# Altium project Robot Controller.PrjPcb
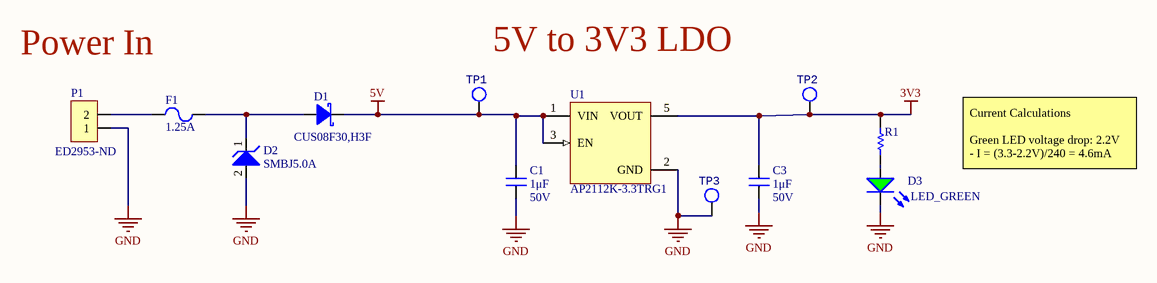
[diagram p0: SH1 - POWER.SchDoc]
6 sheets, 219 parts. Net scope: flat (ports and power ports of the same name join across sheets).
Board file: Robot Controller.PcbDoc
Sheets:
  SH1 - POWER.SchDoc
  SH2 - MCU.SchDoc
  SH3 - USB.SchDoc
  SH4 - GIMBDRIVE CONTROLS.SchDoc
  SH5 - ARM CONTROLS.SchDoc
  SH6 - SCIENCE CONTROLS.SchDoc

## Sheet SH1 - POWER.SchDoc: Power
size B; CheckedBy: Lance Bantoto; Engineer: Christopher Arjune; Organization: UW Robotics; Address1: 200 University Avenue; Address2: Waterloo; Address3: Ontario; Address4: Canada N2L 3G6; Revision: 1; SheetNumber: 1; SheetTotal: 6

### Parts
C1  value 1μF  Voltage Rating: 50V  [CAP2012]  (hidden comment: CAP_1uF_50V_0805)
C3  value 1μF  Voltage Rating: 50V  [CAP2012]  (hidden comment: CAP_1uF_50V_0805)
D1  Manufacturer Part Number 1: CUS08F30,H3F  [SOD-323_UNIDIR]  (hidden comment: DIO_SCHOTTKY_30V_800mA)
D2  TVS_DIODE_UNIDIR_5V  [SMBJ5.0A]  (value not drawn)
D3  LED_GREEN  [LED_0805_GREEN]
F1  Current Rating: 1.25A  [FUSE_1206]  (hidden comment: FUSE_1.25A_1206)
P1  Supplier Part Number 1: ED2953-ND  [OSTYK51102030]  (hidden comment: CONN_TERMINAL_2)
R1  240  [RESC0805]  (value not drawn)
TP1  TESTPOINT_LOOP  [TESTPOINT_LOOP]  (value not drawn)
TP2  TESTPOINT_LOOP  [TESTPOINT_LOOP]  (value not drawn)
TP3  TESTPOINT_LOOP  [TESTPOINT_LOOP]  (value not drawn)
U1  Manufacturer Part Number 1: AP2112K-3.3TRG1  [SOT95P285X140-5N]  (hidden comment: LDO_3.3V_600mA)

### Nets
3V3: C3.1 R1.2 TP2.1 U1.5(VOUT)
5V: C1.1 D1.2(Cathode) TP1.1 U1.1(VIN) U1.3(EN)
GND: C1.2 C3.2 D2.2 D3.2(K) P1.1 TP3.1 U1.2(GND)
NetD1_1: D1.1(Anode) D2.1 F1.2
NetD3_1: D3.1(A) R1.1
NetF1_1: F1.1 P1.2

### Notes on the sheet
- Power In
- 5V to 3V3 LDO
- Current Calculations
  Green LED voltage drop: 2.2V
  - I = (3.3-2.2V)/240 = 4.6mA
- Title:
- Project:
- Date:
- Rev:
- Checker:
- Engineer:
- Sheet:
- of

### Library data of the parts
C1 C3 = CAP_1uF_50V_0805: CAP CER 1UF 50V X7R 0805; Manufacturer 1: Samsung Electro-Mechanics; Manufacturer Part Number 1: CL21B105KBFNNNG; Package/Footprint: 0805; Supplier 1: Digi-Key; Supplier Part Number 1: 1276-6470-1-ND; Mounting Type: SMD; LCSC Part #: C28323
D1 = DIO_SCHOTTKY_30V_800mA: DIODE SCHOTTKY 30V 800MA USC; Manufacturer 1: Toshiba Semiconductor and Storage; Vf (Max): 220mV; Supplier 1: Digi-Key; Supplier Part Number 1: CUS08F30H3FCT-ND; Vr (Max): 30V; Io: 800mA; Mounting Type: SMD
D2 = TVS_DIODE_UNIDIR_5V: TVS DIODE 5V 9.2V SMB; Manufacturer 1: Bourns; Supplier 1: Digi-Key; Supplier Part Number 1: SMBJ5.0ABCT-ND; Manufacturer Part Number 1: SMBJ5.0A; Mounting Type: SMD; Package/Footprint: SMB
D3 = LED_GREEN: LED GREEN DIFFUSED 0805 SMD; Manufacturer Part Number 1: LG R971-KN-1; Manufacturer 1: OSRAM; Forward Voltage Drop: 2.2V; Package/Footprint: 0805; Supplier Part Number 1: 475-1410-1-ND; Supplier 1: Digi-Key; Mounting Type: SMD
F1 = FUSE_1.25A_1206: FUSE BOARD MOUNT 1.25A 63VAC/VDC 1206; Manufacturer 1: Littelfuse; Manufacturer Part Number 1: 04661.25NRHF; Voltage Rating (DC): 63V; Package/Footprint: 1206; Supplier 1: Digi-Key; Supplier Part Number 1: F11418CT-ND; Mounting Type: SMD; LCSC Part #: *
P1 = CONN_TERMINAL_2: Header, 2-Pin; Manufacturer 1: On Shore Technology Inc.; Manufacturer Part Number 1: OSTYK51102030; Supplier 1: Digi-Key
R1 = RES_240Ω_0805_1%: RES 240 OHM 1% 1/8W 0805; Manufacturer 1: Vishay; Manufacturer Part Number 1: CRCW0805240RFKEA; Supplier 1: Digi-Key; Supplier Part Number 1: 541-240CCT-ND
TP1-TP3 = TESTPOINT_LOOP: TESTPOINT THRUHOLE; Manufacturer 1: Keystone Electronics; Manufacturer Part Number 1: 5002; Package/Footprint: TH; Supplier Part Number 1: 36-5002-ND; Supplier 1: Digi-Key; Mounting Type: TH
U1 = LDO_3.3V_600mA: IC REG LINEAR 3.3V 600MA SOT25; Manufacturer 1: Diodes Incorporated; Input Voltage (Max): 6V; Voltage Dropout (Max): 0.4V; Package/Footprint: SOT-25; Supplier 1: Digi-Key; Supplier Part Number 1: AP2112K-3.3TRG1DICT-ND; Output Voltage (Fixed): 3.3V; Output Current: 600mA; Operating Temperature: -40°C - 85°C; LCSC Part #: C51118; Mounting Type: SMD

## Sheet SH2 - MCU.SchDoc: Microcontroller
size B; CheckedBy: Lance Bantoto; Engineer: Christopher Arjune; Organization: UW Robotics; Address1: 200 University Avenue; Address2: Waterloo; Address3: Ontario; Address4: Canada N2L 3G6; Revision: 1; SheetNumber: 2; SheetTotal: 6
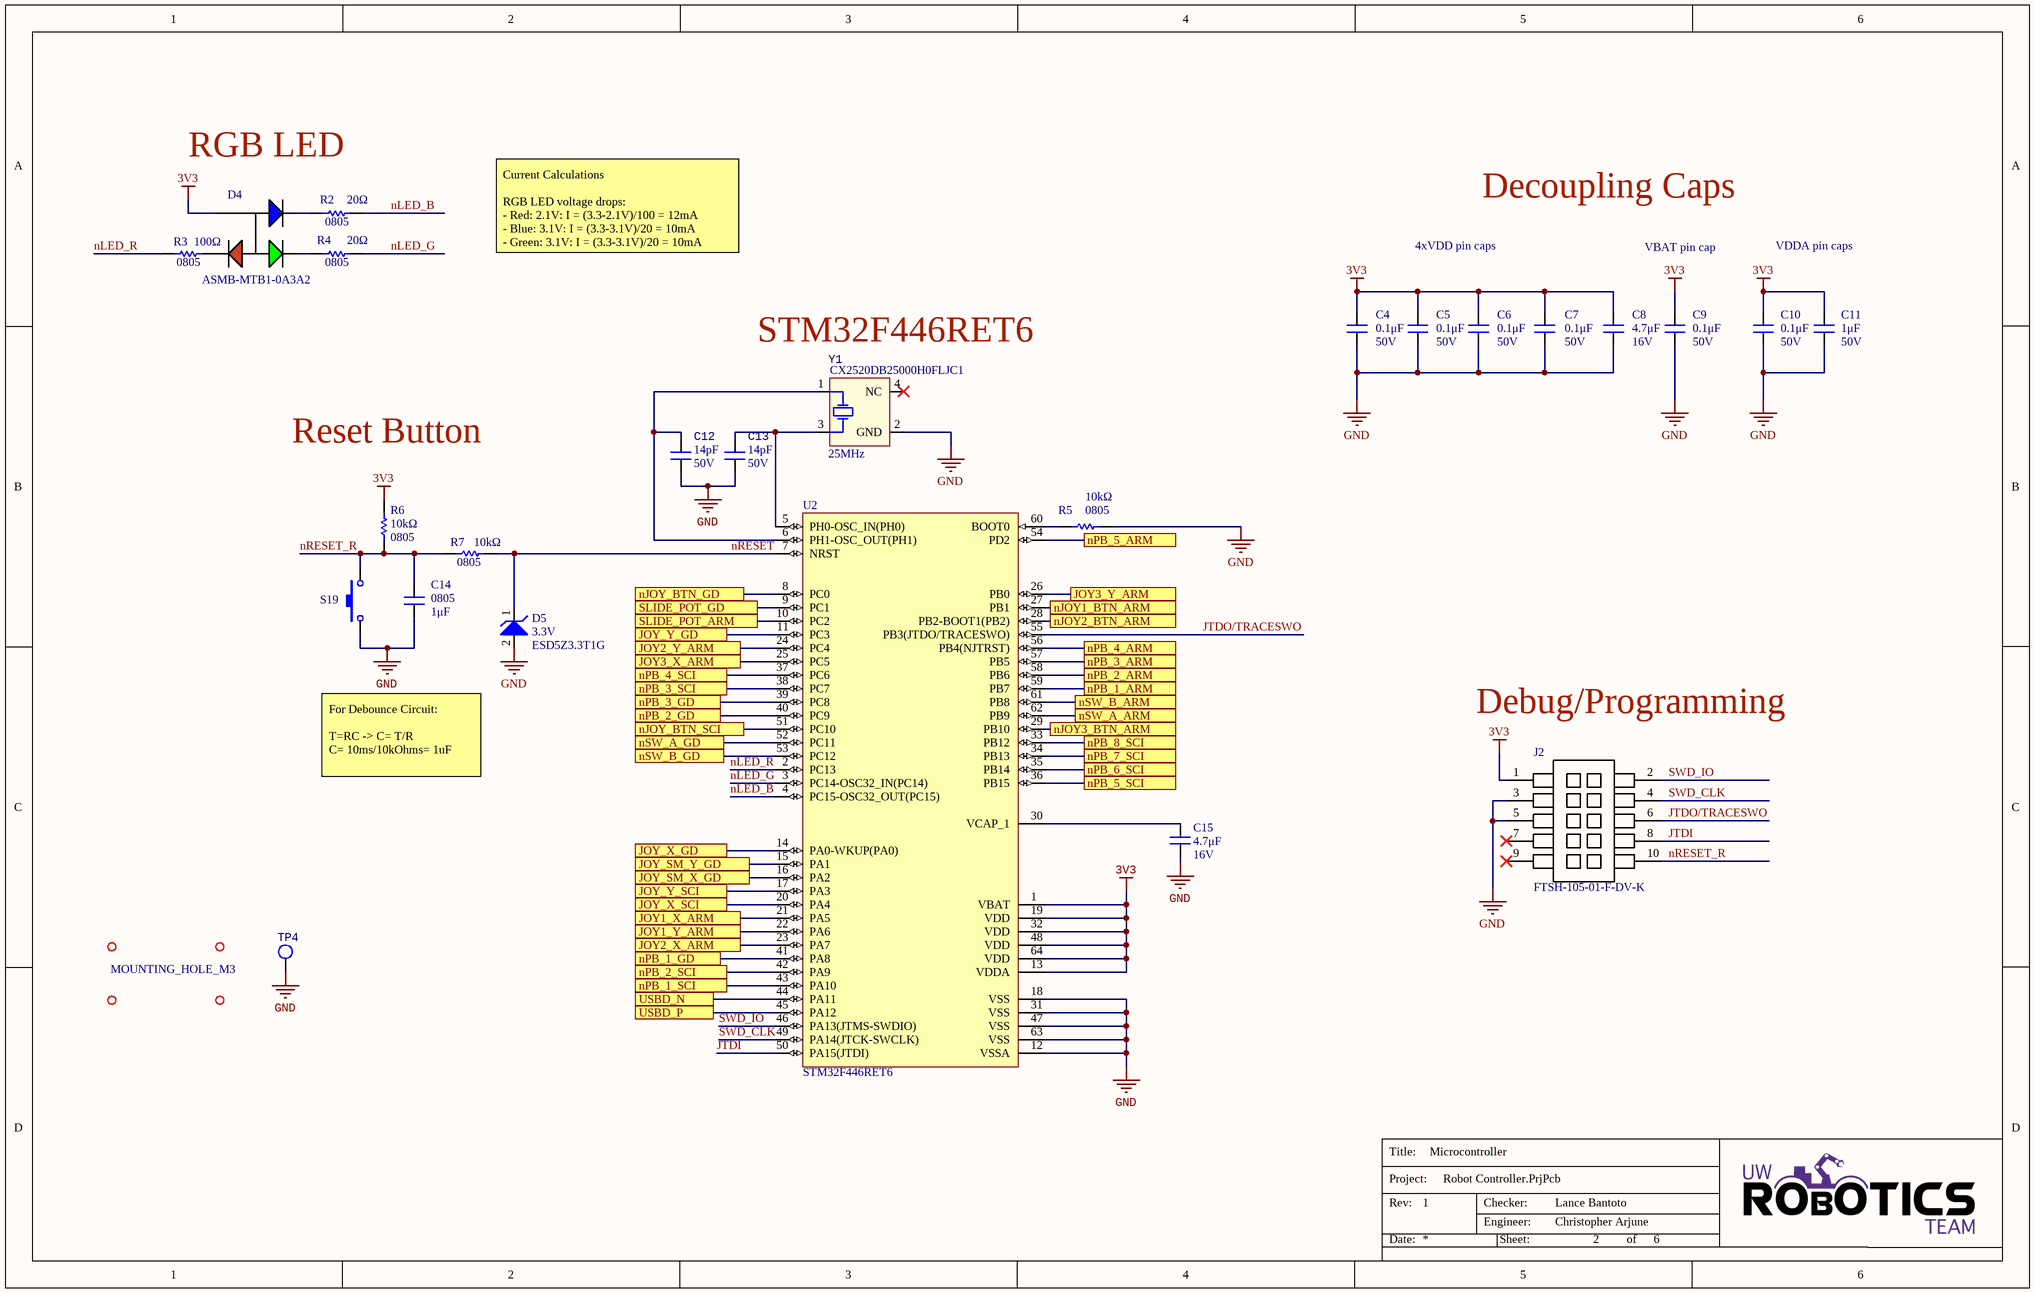
[diagram p1: SH2 - MCU.SchDoc]

### Parts
C4  value 0.1μF  Voltage Rating: 50V  [CAP2012]  (hidden comment: CAP_0.1uF_50V_0805)
C5  value 0.1μF  Voltage Rating: 50V  [CAP2012]  (hidden comment: CAP_0.1uF_50V_0805)
C6  value 0.1μF  Voltage Rating: 50V  [CAP2012]  (hidden comment: CAP_0.1uF_50V_0805)
C7  value 0.1μF  Voltage Rating: 50V  [CAP2012]  (hidden comment: CAP_0.1uF_50V_0805)
C8  value 4.7μF  Voltage Rating: 16V  [CAP2012]  (hidden comment: CAP_4.7uF_16V_0805)
C9  value 0.1μF  Voltage Rating: 50V  [CAP2012]  (hidden comment: CAP_0.1uF_50V_0805)
C10  value 0.1μF  Voltage Rating: 50V  [CAP2012]  (hidden comment: CAP_0.1uF_50V_0805)
C11  value 1μF  Voltage Rating: 50V  [CAP2012]  (hidden comment: CAP_1uF_50V_0805)
C12  value 14pF  Voltage Rating: 50V  [CAP0603]  (hidden comment: CAP_14pF_50V_0603)
C13  value 14pF  Voltage Rating: 50V  [CAP0603]  (hidden comment: CAP_14pF_50V_0603)
C14  value 1μF  Package/Footprint: 0805  [CAP2012]  (hidden comment: CAP_1uF_50V_0805)
C15  value 4.7μF  Voltage Rating: 16V  [CAP2012]  (hidden comment: CAP_4.7uF_16V_0805)
D4  Manufacturer Part Number 1: ASMB-MTB1-0A3A2  [LED_RGB]  (hidden comment: LED_RGB)
D5  Manufacturer Part Number 1: ESD5Z3.3T1G  Voltage - Reverse Standoff (Typ): 3.3V  (hidden comment: TVS_DIODE_UNIDIR_3.3V)
J2  Manufacturer Part Number 1: FTSH-105-01-F-DV-K  [FTSH-105-01-F-DV-K-P-TR]  (hidden comment: CON_PROGRAMMING)
MH1  MOUNTING_HOLE_M3  [MOUNTING_HOLE_3mm]  (value not drawn)  (no BOM)
MH2  MOUNTING_HOLE_M3  [MOUNTING_HOLE_3mm]  (value not drawn)  (no BOM)
MH3  MOUNTING_HOLE_M3  [MOUNTING_HOLE_3mm]  (no BOM)
MH4  MOUNTING_HOLE_M3  [MOUNTING_HOLE_3mm]  (value not drawn)  (no BOM)
R2  value 20Ω  Package/Footprint: 0805  [RESC0805]  (hidden comment: RES_20Ω_0805_1%)
R3  value 100Ω  Package/Footprint: 0805  [RESC0805]  (hidden comment: RES_100Ω_0805_1%)
R4  value 20Ω  Package/Footprint: 0805  [RESC0805]  (hidden comment: RES_20Ω_0805_1%)
R5  value 10kΩ  Package/Footprint: 0805  [RESC0805]  (hidden comment: RES_10kΩ_0805_5%)
R6  value 10kΩ  Package/Footprint: 0805  [RESC0805]  (hidden comment: RES_10kΩ_0805_5%)
R7  value 10kΩ  Package/Footprint: 0805  [RESC0805]  (hidden comment: RES_10kΩ_0805_5%)
S19  SW_TACTILE  [B3U-1000P]  (value not drawn)
TP4  TESTPOINT_LOOP  [TESTPOINT_LOOP]  (value not drawn)
U2  STM32F446RET6  [STM-LQFP64_L]
Y1  Manufacturer Part Number 1: CX2520DB25000H0FLJC1  Frequency: 25MHz  [SOIC254P1016X440-4N]  (hidden comment: CRYSTAL_25MHZ)

### Ports
JOY1_X_ARM, JOY1_Y_ARM, JOY2_X_ARM, JOY2_Y_ARM, JOY3_X_ARM, JOY3_Y_ARM, JOY_SM_X_GD, JOY_SM_Y_GD, JOY_X_GD, JOY_X_SCI, JOY_Y_GD, JOY_Y_SCI, nJOY1_BTN_ARM, nJOY2_BTN_ARM, nJOY3_BTN_ARM, nJOY_BTN_GD, nJOY_BTN_SCI, nPB_1_ARM, nPB_1_GD, nPB_1_SCI, nPB_2_ARM, nPB_2_GD, nPB_2_SCI, nPB_3_ARM, nPB_3_GD, nPB_3_SCI, nPB_4_ARM, nPB_4_SCI, nPB_5_ARM, nPB_5_SCI, nPB_6_SCI, nPB_7_SCI, nPB_8_SCI, nSW_A_ARM, nSW_A_GD, nSW_B_ARM, nSW_B_GD, SLIDE_POT_ARM, SLIDE_POT_GD, USBD_N, USBD_P

### Nets
3V3: C4.2 C5.2 C6.2 C7.2 C8.2 C9.2 C10.2 C11.2 D4.4(COMMON_ANODE) J2.1 R6.2 U2.1(VBAT) U2.13(VDDA) U2.19(VDD) U2.32(VDD) U2.48(VDD) U2.64(VDD)
GND: C4.1 C5.1 C6.1 C7.1 C8.1 C9.1 C10.1 C11.1 C12.1 C13.1 C14.1 C15.1 D5.2 J2.3 J2.5 R5.2 S19.2 TP4.1 U2.12(VSSA) U2.18(VSS) U2.31(VSS) U2.47(VSS) U2.63(VSS) Y1.2(GND)
JTDI: J2.8 U2.50(PA15(JTDI))
JTDO/TRACESWO: J2.6 U2.55(PB3(JTDO/TRACESWO))
nLED_B: R2.2 U2.4(PC15-OSC32_OUT(PC15))
nLED_G: R4.2 U2.3(PC14-OSC32_IN(PC14))
nLED_R: R3.1 U2.2(PC13)
nRESET: D5.1 R7.2 U2.7(NRST)
nRESET_R: C14.2 J2.10 R6.1 R7.1 S19.1
SWD_CLK: J2.4 U2.49(PA14(JTCK-SWCLK))
SWD_IO: J2.2 U2.46(PA13(JTMS-SWDIO))
USBD_N: U2.44(PA11) ; port USBD_N
USBD_P: U2.45(PA12) ; port USBD_P
NetC12_2: C12.2 U2.6(PH1-OSC_OUT(PH1)) Y1.1(HOT)
NetC13_2: C13.2 U2.5(PH0-OSC_IN(PH0)) Y1.3(HOT)
NetC15_2: C15.2 U2.30(VCAP_1)
NetC17_2: U2.9(PC1) ; port SLIDE_POT_GD
NetC18_2: U2.41(PA8) ; port nPB_1_GD
NetC19_2: U2.15(PA1) ; port JOY_SM_Y_GD
NetC20_2: U2.16(PA2) ; port JOY_SM_X_GD
NetC21_2: U2.40(PC9) ; port nPB_2_GD
NetC22_2: U2.39(PC8) ; port nPB_3_GD
NetC23_2: U2.8(PC0) ; port nJOY_BTN_GD
NetC24_2: U2.14(PA0-WKUP(PA0)) ; port JOY_X_GD
NetC25_2: U2.11(PC3) ; port JOY_Y_GD
NetC26_2: U2.52(PC11) ; port nSW_A_GD
NetC27_2: U2.53(PC12) ; port nSW_B_GD
NetC28_2: U2.59(PB7) ; port nPB_1_ARM
NetC29_2: U2.62(PB9) ; port nSW_A_ARM
NetC30_2: U2.61(PB8) ; port nSW_B_ARM
NetC31_2: U2.58(PB6) ; port nPB_2_ARM
NetC32_2: U2.27(PB1) ; port nJOY1_BTN_ARM
NetC33_2: U2.21(PA5) ; port JOY1_X_ARM
NetC34_2: U2.22(PA6) ; port JOY1_Y_ARM
NetC35_2: U2.10(PC2) ; port SLIDE_POT_ARM
NetC36_2: U2.57(PB5) ; port nPB_3_ARM
NetC37_2: U2.28(PB2-BOOT1(PB2)) ; port nJOY2_BTN_ARM
NetC38_2: U2.23(PA7) ; port JOY2_X_ARM
NetC39_2: U2.24(PC4) ; port JOY2_Y_ARM
NetC40_2: U2.56(PB4(NJTRST)) ; port nPB_4_ARM
NetC41_2: U2.54(PD2) ; port nPB_5_ARM
NetC42_2: U2.29(PB10) ; port nJOY3_BTN_ARM
NetC43_2: U2.25(PC5) ; port JOY3_X_ARM
NetC44_2: U2.26(PB0) ; port JOY3_Y_ARM
NetC45_2: U2.43(PA10) ; port nPB_1_SCI
NetC46_2: U2.36(PB15) ; port nPB_5_SCI
NetC47_2: U2.51(PC10) ; port nJOY_BTN_SCI
NetC48_2: U2.20(PA4) ; port JOY_X_SCI
NetC49_2: U2.17(PA3) ; port JOY_Y_SCI
NetC50_2: U2.42(PA9) ; port nPB_2_SCI
NetC51_2: U2.35(PB14) ; port nPB_6_SCI
NetC52_2: U2.38(PC7) ; port nPB_3_SCI
NetC53_2: U2.33(PB12) ; port nPB_8_SCI
NetC54_2: U2.37(PC6) ; port nPB_4_SCI
NetC55_2: U2.34(PB13) ; port nPB_7_SCI
NetD4_1: D4.1(CATHODE_(RED)) R3.2
NetD4_2: D4.2(CATHODE_(GREEN)) R4.1
NetD4_3: D4.3(CATHODE_(BLUE)) R2.1
NetR5_1: R5.1 U2.60(BOOT0)

Not connected (* = marked no-connect by the designer): J2 7* 9*; Y1 4(NC)*

### Notes on the sheet
- RGB LED
- Decoupling Caps
- Current Calculations
  RGB LED voltage drops:
  - Red: 2.1V: I = (3.3-2.1V)/100 = 12mA
  - Blue: 3.1V: I = (3.3-3.1V)/20 = 10mA
  - Green: 3.1V: I = (3.3-3.1V)/20 = 10mA
- 4xVDD pin caps
- VBAT pin cap
- VDDA pin caps
- (near Y1) STM32F446RET6
- Reset Button
- For Debounce Circuit:
  T=RC -> C= T/R
  C= 10ms/10kOhms= 1uF
- Debug/Programming
- Title:
- Project:
- Date:
- Rev:
- Checker:
- Engineer:
- Sheet:
- of

### Library data of the parts
C4-C7 C9 C10 = CAP_0.1uF_50V_0805: CAP CER 0.1UF 50V X7R 0805; Manufacturer 1: Murata Electronics; Manufacturer Part Number 1: GCM21BR71H104KA37K; Package/Footprint: 0805; Supplier 1: Digi-Key; Supplier Part Number 1: 490-8049-1-ND; Mounting Type: SMD; LCSC Part #: C49678; Dielectric: X7R
C8 C15 = CAP_4.7uF_16V_0805: CAP CER 4.7UF 16V X5R 0805; Manufacturer 1: Samsung Electro-Mechanics; Manufacturer Part Number 1: CL21A475KOFNNNE; Package/Footprint: 0805; Supplier 1: Digi-Key; Supplier Part Number 1: 1276-1065-1-ND; Mounting Type: SMD; LCSC Part #: C1779; Dielectric: X5R
C11 = CAP_1uF_50V_0805: as C1 on sheet SH1 - POWER; Supplier 1: Digi-Key; Supplier Part Number 1: 1276-6470-1-ND; Mounting Type: SMD; LCSC Part #: C28323
C12 C13 = CAP_14pF_50V_0603: CAP CER 14PF 50V C0G/NP0 0603; Manufacturer 1: Samsung; Manufacturer Part Number 1: CL10C140JB8NNNC; Dielectric: C0G; Package/Footprint: 0603; Supplier Part Number 1: 1276-2187-1-ND; Supplier 1: Digi-Key; Mounting Type: SMD
C14 = CAP_1uF_50V_0805: CAP CER 1UF 50V X7R 0805; Manufacturer 1: Samsung Electro-Mechanics; Manufacturer Part Number 1: CL21B105KBFNNNG; Supplier 1: Digi-Key; Supplier Part Number 1: 1276-6470-1-ND; Voltage Rating: 50V; Mounting Type: SMD; LCSC Part #: C28323
D4 = LED_RGB: LED RGB DIFFUSED 4PLCC SMD; Manufacturer 1: Broadcom; Color: Blue,Green,Red; Lens Color: White; Viewing Angle: 115°; Lens Style: Round; Luminous Intensity: 350mcd; Dominant Wavelength: 470nm; Forward Voltage: 3.1V; Test Current: 20mA; Package/Footprint: 4-PLCC; Supplier 1: Digi-Key; Number of Pins: 4; Lens Transparency: Diffused; Supplier Part Number 1: 516-3280-1-ND; Mounting Type: SMD
D5 = TVS_DIODE_UNIDIR_3.3V: TVS DIODE 3.3V 14.1V SOD523; Manufacturer 1: ON Semiconductor; Package/Footprint: SOD-523; Voltage - Breakdown (Min): 5V; Supplier 1: Digi-Key; Supplier Part Number 1: ESD5Z3.3T1GOSCT-ND; Mounting Type: SMD; LCSC Part #: C61148; Voltage - Clamping (Max) @ Ipp: 14.1V
J2 = CON_PROGRAMMING: CONN HEADER SMD 10POS 1.27MM; Manufacturer 1: Samtec; Supplier 1: Digi-Key; Pitch: 1.27mm; Supplier Part Number 1: SAM8796-ND; Mounting Type: SMD; Package/Footprint: SMD
R2 R4 = RES_20Ω_0805_1%: RES 20 OHM 1% 1/8W 0805; Manufacturer 1: Yageo; Manufacturer Part Number 1: RC0805FR-0720RL; Supplier 1: Digi-Key; Supplier Part Number 1: 311-20.0CRCT-ND; Mounting Type: SMD; LCSC Part #: C17581
R3 = RES_100Ω_0805_1%: RES 100 OHM 1% 1/8W 0805; Manufacturer 1: Vishay Dale; Manufacturer Part Number 1: CRCW0805100RFKEA; Supplier 1: Digi-Key; Supplier Part Number 1: 541-100CCT-ND; Mounting Type: SMD; LCSC Part #: C1790
R5-R7 = RES_10kΩ_0805_5%: RES 10K OHM 5% 1/8W 0805; Manufacturer 1: Panasonic Electronic Components; Manufacturer Part Number 1: ERJ-6GEYJ103V; Supplier 1: Digi-Key; Supplier Part Number 1: P10KACT-ND; LCSC Part #: C17414; Mounting Type: SMD
S19 = SW_TACTILE: SWITCH TACTILE SPST-NO 0.05A 12V; Manufacturer 1: Omron Electronics Inc-EMC Div; Package/Footprint: SMD; Manufacturer Part Number 1: B3U-1000P; Supplier 1: Digi-Key; Supplier Part Number 1: SW1020CT-ND; Mounting Type: SMD
TP4 = TESTPOINT_LOOP: TESTPOINT THRUHOLE; Manufacturer Part Number 1: 5002; Manufacturer 1: Keystone Electronics; Package/Footprint: TH; Supplier Part Number 1: 36-5002-ND; Supplier 1: Digi-Key; Mounting Type: TH
U2 = MCU_STM32F446RET6: ARM Cortex-M4 32-bit MCU+FPU, 512 KB Flash, 128 KB Internal RAM, 50 I/Os, 64-Pin LQFP, -40 to 85 degC, Tray; I/Os (High Current): 50; Supply Voltage(Vcc) min (V): 1.7; Operating Frequency(F) (Processor speed) (MHz): 180; D/A Converter: 2; Internal RAM Size (kB): 128; FLASH Size (Prog) (kB): 512; Core: ARM Cortex-M4; ComponentLink1Description: Manufacturer URL; Package Reference: 64-Pin Low-profile Quad Flat Package, Body 10 x 10 mm, Pitch 0.5 mm; ComponentLink2URL: http://www.st.com/st-web-ui/static/active/en/resource/technical/document/datasheet/DM00141306.pdf; Packing: Tray; DatasheetVersion: Rev. 6; ComponentLink1URL: http://www.st.com/; ComponentLink2Description: Datasheet; Package Description: LQFP64; Mounting Technology: Surface Mount; Supplier Part Number 1: 497-15376-ND; Supplier 1: Digi-Key
Y1 = CRYSTAL_25MHZ: CRYSTAL 25.0000MHZ 12PF SMD; Manufacturer 1: Kyocera AVX; Supplier 1: Digi-Key; Supplier Part Number 1: 1253-1724-1-ND; Load Capacitance: 12pF; Mounting Type: SMD; Package/Footprint: SMD

## Sheet SH3 - USB.SchDoc: USB
size B; CheckedBy: Lance Bantoto; Engineer: Christopher Arjune; Organization: UW Robotics; Address1: 200 University Avenue; Address2: Waterloo; Address3: Ontario; Address4: Canada N2L 3G6; Revision: 1; SheetNumber: 3; SheetTotal: 6
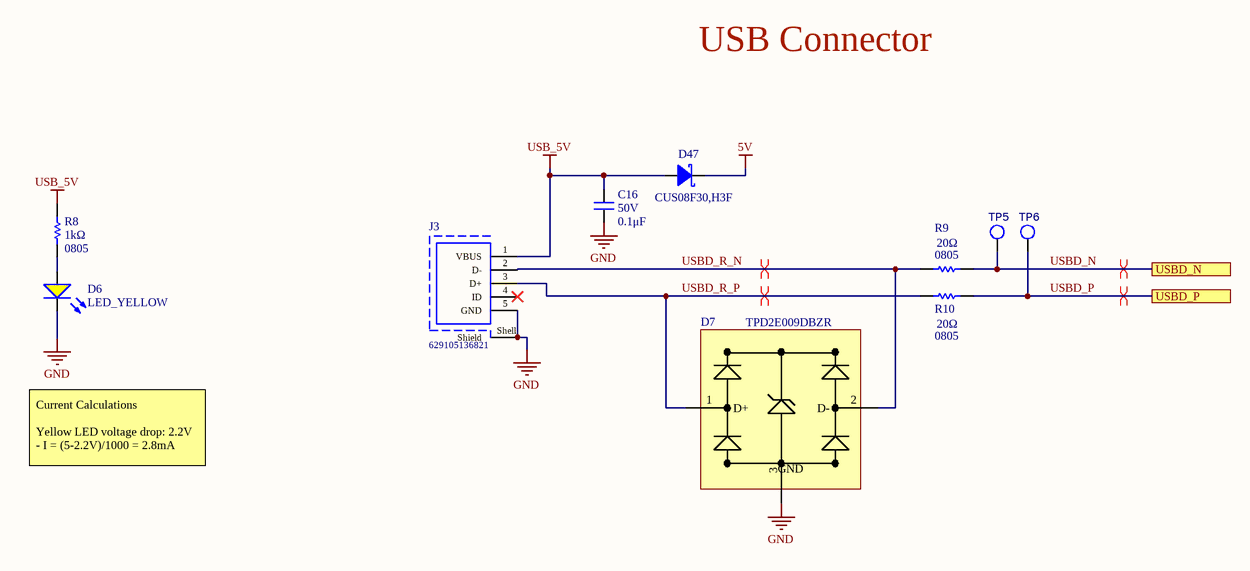
[diagram p2: SH3 - USB.SchDoc]

### Parts
C16  value 0.1μF  Voltage Rating: 50V  [CAP2012]  (hidden comment: CAP_0.1uF_50V_0805)
D6  LED_YELLOW  [LED_0805_YELLOW]
D7  Manufacturer Part Number 1: TPD2E009DBZR  [SOT23-3]  (hidden comment: TVS_DIODE_USB_5.5V)
D47  Manufacturer Part Number 1: CUS08F30,H3F  [SOD-323_UNIDIR]  (hidden comment: DIO_SCHOTTKY_30V_800mA)
J3  629105136821  [629105136821]
R8  Package/Footprint: 0805  Parameter 1: 1kΩ  [RESC0805]  (hidden comment: RES_1kΩ_0805_1%)
R9  value 20Ω  Package/Footprint: 0805  [RESC0805]  (hidden comment: RES_20Ω_0805_1%)
R10  value 20Ω  Package/Footprint: 0805  [RESC0805]  (hidden comment: RES_20Ω_0805_1%)
TP5  TESTPOINT_LOOP  [TESTPOINT_LOOP]  (value not drawn)
TP6  TESTPOINT_LOOP  [TESTPOINT_LOOP]  (value not drawn)

### Ports
USBD_N, USBD_P

### Nets
5V: D47.2(Cathode)
GND: C16.2 D6.2(K) D7.3(GND) J3.5(GND) J3.Shell(Shield)
USB_5V: C16.1 D47.1(Anode) J3.1(VBUS) R8.2
USBD_N: R9.2 TP5.1 ; port USBD_N
USBD_P: R10.2 TP6.1 ; port USBD_P
USBD_R_N: D7.2(D-) J3.2(D-) R9.1
USBD_R_P: D7.1(D+) J3.3(D+) R10.1
NetD6_1: D6.1(A) R8.1

Not connected (* = marked no-connect by the designer): J3 4(ID)*

### Layout directives
differential pair: USBD_N, USBD_P, USBD_R_N, USBD_R_P

### Notes on the sheet
- USB Connector
- Current Calculations
  Yellow LED voltage drop: 2.2V
  - I = (5-2.2V)/1000 = 2.8mA
- Title:
- Project:
- Date:
- Rev:
- Checker:
- Engineer:
- Sheet:
- of

### Library data of the parts
C16 = CAP_0.1uF_50V_0805: as C4 on sheet SH2 - MCU; Supplier 1: Digi-Key; Supplier Part Number 1: 490-8049-1-ND; Mounting Type: SMD; Dielectric: X7R; LCSC Part #: C49678
D6 = LED_YELLOW: LED YELLOW DIFFUSED 0805 SMD; Manufacturer 1: OSRAM; Manufacturer Part Number 1: LY R976-PS-36; Forward Voltage Drop: 2.2V; Package: 0805 (2012 Metric); Supplier Part Number 1: 475-2560-1-ND; Supplier 1: Digi-Key
D7 = TVS_DIODE_USB_5.5V: TVS DIODE 5.5V 8V SOT23-3; Manufacturer 1: Texas Instruments; Package/Footprint: SOT-23-3; Supplier 1: Digi-Key; Supplier Part Number 1: 296-24657-1-ND; Verified: No; Mounting Type: SMD
D47 = DIO_SCHOTTKY_30V_800mA: as D1 on sheet SH1 - POWER; Supplier 1: Digi-Key; Supplier Part Number 1: CUS08F30H3FCT-ND; Vr (Max): 30V; Io: 800mA; Mounting Type: SMD
J3 = CMP-1502-03253-1: Micro USB 2.0 Type B Receptacle WR-COM, Horizontal, SMT, with Pads and Pegs; Manufacturer: Wurth Elektronik; Contact Resistance: 30mOhm; Rated Current: 1A; Working Voltage: 30VAC; Datasheet URL: https://katalog.we-online.de/em/datasheet/629105136821.pdf; Mounting Technology: SMT; Publisher: WurthElektronik; Package Reference: 629105136821; Orientation: Horizontal; Packaging: TapeandReel; Part Number: 629105136821; Manufacturer URL: http://www.we-online.de; Connector Type: MicroUSB2.0TypeB; Gender: Receptacle; Operating Temperature: -40to105degC
R8 = RES_1kΩ_0805_1%: RES 1K OHM 1% 1/8W 0805; Manufacturer 1: Yageo; Manufacturer Part Number 1: RC0805FR-071KL; Supplier 1: Digi-Key; Supplier Part Number 1: 311-1.00KCRCT-ND; Mounting Type: SMD; LCSC Part #: C17513
R9 R10 = RES_20Ω_0805_1%: RES 20 OHM 1% 1/8W 0805; Manufacturer Part Number 1: RC0805FR-0720RL; Manufacturer 1: Yageo; Supplier 1: Digi-Key; Supplier Part Number 1: 311-20.0CRCT-ND; Mounting Type: SMD; LCSC Part #: C17581
TP5 TP6 = TESTPOINT_LOOP: as TP4 on sheet SH2 - MCU; Supplier Part Number 1: 36-5002-ND; Supplier 1: Digi-Key; Mounting Type: TH

## Sheet SH4 - GIMBDRIVE CONTROLS.SchDoc: GimbDrive Controls
size B; CheckedBy: Lance Bantoto; Engineer: Christopher Arjune; Organization: UW Robotics; Address1: 200 University Avenue; Address2: Waterloo; Address3: Ontario; Address4: Canada N2L 3G6; Revision: 1; SheetNumber: 4; SheetTotal: 6
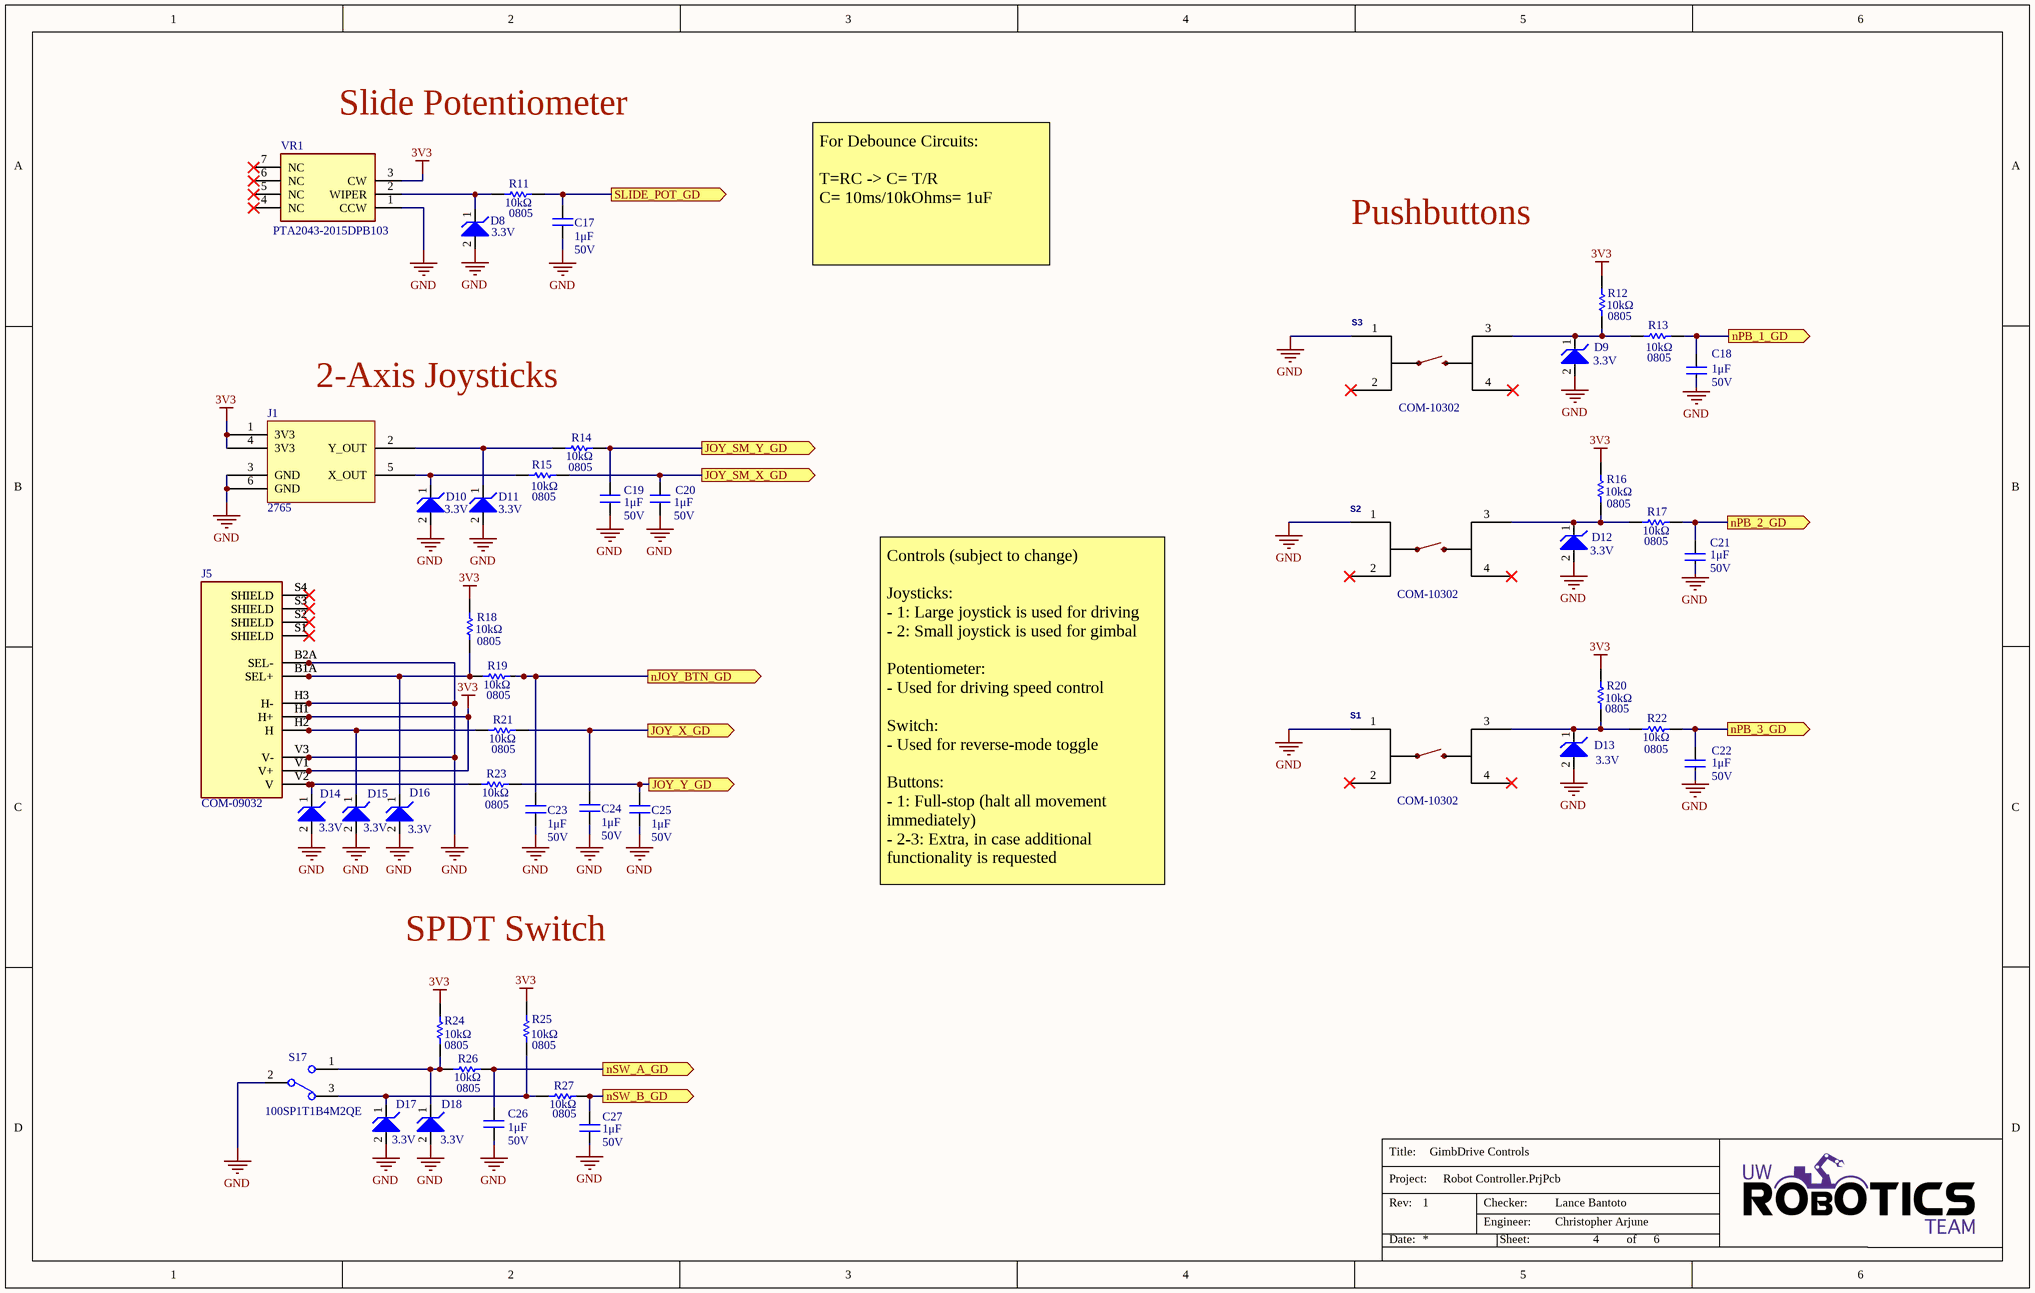
[diagram p3: SH4 - GIMBDRIVE CONTROLS.SchDoc]

### Parts
C17  value 1μF  Voltage Rating: 50V  [CAP2012]  (hidden comment: CAP_1uF_50V_0805)
C18  value 1μF  Voltage Rating: 50V  [CAP2012]  (hidden comment: CAP_1uF_50V_0805)
C19  value 1μF  Voltage Rating: 50V  [CAP2012]  (hidden comment: CAP_1uF_50V_0805)
C20  value 1μF  Voltage Rating: 50V  [CAP2012]  (hidden comment: CAP_1uF_50V_0805)
C21  value 1μF  Voltage Rating: 50V  [CAP2012]  (hidden comment: CAP_1uF_50V_0805)
C22  value 1μF  Voltage Rating: 50V  [CAP2012]  (hidden comment: CAP_1uF_50V_0805)
C23  value 1μF  Voltage Rating: 50V  [CAP2012]  (hidden comment: CAP_1uF_50V_0805)
C24  value 1μF  Voltage Rating: 50V  [CAP2012]  (hidden comment: CAP_1uF_50V_0805)
C25  value 1μF  Voltage Rating: 50V  [CAP2012]  (hidden comment: CAP_1uF_50V_0805)
C26  value 1μF  Voltage Rating: 50V  [CAP2012]  (hidden comment: CAP_1uF_50V_0805)
C27  value 1μF  Voltage Rating: 50V  [CAP2012]  (hidden comment: CAP_1uF_50V_0805)
D8  Voltage - Reverse Standoff (Typ): 3.3V  (hidden comment: TVS_DIODE_UNIDIR_3.3V)
D9  Voltage - Reverse Standoff (Typ): 3.3V  (hidden comment: TVS_DIODE_UNIDIR_3.3V)
D10  Voltage - Reverse Standoff (Typ): 3.3V  (hidden comment: TVS_DIODE_UNIDIR_3.3V)
D11  Voltage - Reverse Standoff (Typ): 3.3V  (hidden comment: TVS_DIODE_UNIDIR_3.3V)
D12  Voltage - Reverse Standoff (Typ): 3.3V  (hidden comment: TVS_DIODE_UNIDIR_3.3V)
D13  Voltage - Reverse Standoff (Typ): 3.3V  (hidden comment: TVS_DIODE_UNIDIR_3.3V)
D14  Voltage - Reverse Standoff (Typ): 3.3V  (hidden comment: TVS_DIODE_UNIDIR_3.3V)
D15  Voltage - Reverse Standoff (Typ): 3.3V  (hidden comment: TVS_DIODE_UNIDIR_3.3V)
D16  Voltage - Reverse Standoff (Typ): 3.3V  (hidden comment: TVS_DIODE_UNIDIR_3.3V)
D17  Voltage - Reverse Standoff (Typ): 3.3V  (hidden comment: TVS_DIODE_UNIDIR_3.3V)
D18  Voltage - Reverse Standoff (Typ): 3.3V  (hidden comment: TVS_DIODE_UNIDIR_3.3V)
J1  Manufacturer Part Number 1: 2765  [2_AXIS_JOYSTICK_SMALL]  (hidden comment: 2_AXIS_JOYSTICK_SMALL)
J5  Manufacturer Part Number 1: COM-09032  [2_AXIS_JOYSTICK]  (hidden comment: 2_AXIS_JOYSTICK)
R11  value 10kΩ  Package/Footprint: 0805  [RESC0805]  (hidden comment: RES_10kΩ_0805_5%)
R12  value 10kΩ  Package/Footprint: 0805  [RESC0805]  (hidden comment: RES_10kΩ_0805_5%)
R13  value 10kΩ  Package/Footprint: 0805  [RESC0805]  (hidden comment: RES_10kΩ_0805_5%)
R14  value 10kΩ  Package/Footprint: 0805  [RESC0805]  (hidden comment: RES_10kΩ_0805_5%)
R15  value 10kΩ  Package/Footprint: 0805  [RESC0805]  (hidden comment: RES_10kΩ_0805_5%)
R16  value 10kΩ  Package/Footprint: 0805  [RESC0805]  (hidden comment: RES_10kΩ_0805_5%)
R17  value 10kΩ  Package/Footprint: 0805  [RESC0805]  (hidden comment: RES_10kΩ_0805_5%)
R18  value 10kΩ  Package/Footprint: 0805  [RESC0805]  (hidden comment: RES_10kΩ_0805_5%)
R19  value 10kΩ  Package/Footprint: 0805  [RESC0805]  (hidden comment: RES_10kΩ_0805_5%)
R20  value 10kΩ  Package/Footprint: 0805  [RESC0805]  (hidden comment: RES_10kΩ_0805_5%)
R21  value 10kΩ  Package/Footprint: 0805  [RESC0805]  (hidden comment: RES_10kΩ_0805_5%)
R22  value 10kΩ  Package/Footprint: 0805  [RESC0805]  (hidden comment: RES_10kΩ_0805_5%)
R23  value 10kΩ  Package/Footprint: 0805  [RESC0805]  (hidden comment: RES_10kΩ_0805_5%)
R24  value 10kΩ  Package/Footprint: 0805  [RESC0805]  (hidden comment: RES_10kΩ_0805_5%)
R25  value 10kΩ  Package/Footprint: 0805  [RESC0805]  (hidden comment: RES_10kΩ_0805_5%)
R26  value 10kΩ  Package/Footprint: 0805  [RESC0805]  (hidden comment: RES_10kΩ_0805_5%)
R27  value 10kΩ  Package/Footprint: 0805  [RESC0805]  (hidden comment: RES_10kΩ_0805_5%)
S1  Manufacturer Part Number 1: COM-10302  [TACTILE_SWITCH_PTH_12MM]  (hidden comment: SW_MOMENTARY_PUSHBUTTON)
S2  Manufacturer Part Number 1: COM-10302  [TACTILE_SWITCH_PTH_12MM]  (hidden comment: SW_MOMENTARY_PUSHBUTTON)
S3  Manufacturer Part Number 1: COM-10302  [TACTILE_SWITCH_PTH_12MM]  (hidden comment: SW_MOMENTARY_PUSHBUTTON)
S17  SW_SPDT  [100SP1T1B4M2QE]  (value not drawn)
VR1  Manufacturer Part Number 1: PTA2043-2015DPB103  [PTA20432015CPB103]  (hidden comment: POT_10K_SLIDE)

### Ports
JOY_SM_X_GD (out), JOY_SM_Y_GD (out), JOY_X_GD (out), JOY_Y_GD (out), nJOY_BTN_GD (out), nPB_1_GD (out), nPB_2_GD (out), nPB_3_GD (out), nSW_A_GD (out), nSW_B_GD (out), SLIDE_POT_GD (out)

### Nets
3V3: J1.1(3V3) J1.4(3V3) J5.H1(H+) J5.V1(V+) R12.1 R16.1 R18.1 R20.1 R24.1 R25.1 VR1.3(CW)
GND: C17.1 C18.1 C19.1 C20.1 C21.1 C22.1 C23.1 C24.1 C25.1 C26.1 C27.1 D8.2 D9.2 D10.2 D11.2 D12.2 D13.2 D14.2 D15.2 D16.2 D17.2 D18.2 J1.3(GND) J1.6(GND) J5.B2A(SEL-) J5.H3(H-) J5.V3(V-) S1.1 S2.1 S3.1 S17.2 VR1.1(CCW)
NetC17_2: C17.2 R11.2 ; port SLIDE_POT_GD
NetC18_2: C18.2 R13.2 ; port nPB_1_GD
NetC19_2: C19.2 R14.2 ; port JOY_SM_Y_GD
NetC20_2: C20.2 R15.2 ; port JOY_SM_X_GD
NetC21_2: C21.2 R17.2 ; port nPB_2_GD
NetC22_2: C22.2 R22.2 ; port nPB_3_GD
NetC23_2: C23.2 R19.2 ; port nJOY_BTN_GD
NetC24_2: C24.2 R21.2 ; port JOY_X_GD
NetC25_2: C25.2 R23.2 ; port JOY_Y_GD
NetC26_2: C26.2 R26.2 ; port nSW_A_GD
NetC27_2: C27.2 R27.2 ; port nSW_B_GD
NetD8_1: D8.1 R11.1 VR1.2(WIPER)
NetD9_1: D9.1 R12.2 R13.1 S3.3
NetD10_1: D10.1 J1.5(X_OUT) R15.1
NetD11_1: D11.1 J1.2(Y_OUT) R14.1
NetD12_1: D12.1 R16.2 R17.1 S2.3
NetD13_1: D13.1 R20.2 R22.1 S1.3
NetD14_1: D14.1 J5.V2(V) R23.1
NetD15_1: D15.1 J5.H2(H) R21.1
NetD16_1: D16.1 J5.B1A(SEL+) R18.2 R19.1
NetD17_1: D17.1 R25.2 R27.1 S17.3
NetD18_1: D18.1 R24.2 R26.1 S17.1

Not connected (* = marked no-connect by the designer): J5 S1(SHIELD)* S2(SHIELD)* S3(SHIELD)* S4(SHIELD)*; S1 2* 4*; S2 2* 4*; S3 2* 4*; VR1 4(NC)* 5(NC)* 6(NC)* 7(NC)*

### Notes on the sheet
- (near VR1) Slide Potentiometer
- Pushbuttons
- For Debounce Circuits:
  T=RC -> C= T/R
  C= 10ms/10kOhms= 1uF
- 2-Axis Joysticks
- Controls (subject to change)
  Joysticks:
  - 1: Large joystick is used for driving
  - 2: Small joystick is used for gimbal
  Potentiometer:
  - Used for driving speed control
  Switch:
  - Used for reverse-mode toggle
  Buttons:
  - 1: Full-stop (halt all movement immediately)
  - 2-3: Extra, in case additional functionality is requested
- SPDT Switch
- Title:
- Project:
- Date:
- Rev:
- Checker:
- Engineer:
- Sheet:
- of

### Library data of the parts
C17-C27 = CAP_1uF_50V_0805: as C1 on sheet SH1 - POWER; Supplier 1: Digi-Key; Supplier Part Number 1: 1276-6470-1-ND; Mounting Type: SMD; LCSC Part #: C28323
D8-D18 = TVS_DIODE_UNIDIR_3.3V: TVS DIODE 3.3V 14.1V SOD523; Manufacturer 1: ON Semiconductor; Manufacturer Part Number 1: ESD5Z3.3T1G; Package/Footprint: SOD-523; Voltage - Breakdown (Min): 5V; Supplier 1: Digi-Key; Supplier Part Number 1: ESD5Z3.3T1GOSCT-ND; Mounting Type: SMD; LCSC Part #: C61148; Voltage - Clamping (Max) @ Ipp: 14.1V
J1 = 2_AXIS_JOYSTICK_SMALL: JOYSTICK 10K OHM 2 AXIS TH; Manufacturer 1: Adafruit Industries LLC; Supplier 1: Digi-Key; Supplier Part Number 1: 1528-1730-ND; Mounting Type: TH; Package/Footprint: TH
J5 = 2_AXIS_JOYSTICK: JOYSTICK 10K OHM 2 AXIS TH; Manufacturer 1: SparkFun; Supplier 1: Digi-Key; Supplier Part Number 1: 1568-1526-ND; Verified: No; Mounting Type: TH; Package/Footprint: TH; LCSC Part #: *
R11-R27 = RES_10kΩ_0805_5%: as R5 on sheet SH2 - MCU; Supplier 1: Digi-Key; Supplier Part Number 1: P10KACT-ND; LCSC Part #: C17414; Mounting Type: SMD
S1-S3 = SW_MOMENTARY_PUSHBUTTON: TACTILE MOMENTARY PUSHBUTTON SPST; Manufacturer 1: SparkFun; Package/Footprint: TH; Supplier 1: Digi-Key; Supplier Part Number 1: 1568-1332-ND; Mounting Type: TH; Verified: No
S17 = SW_SPDT: SWITCH TOGGLE SPDT 5A 120V; Manufacturer 1: E-Switch; Voltage Rating (DC): 28V; Package/Footprint: TH; Supplier 1: Digi-Key; Manufacturer Part Number 1: 100SP1T1B4M2QE; Throw Configuration: SPDT; Supplier Part Number 1: EG2355-ND; Mounting Type: TH
VR1 = POT_10K_SLIDE: SLIDE POT 10K OHM 0.1W TOP 20MM; Manufacturer 1: Bourns; Supplier 1: Digi-Key; Supplier Part Number 1: PTA2043-2015DPB103-ND

## Sheet SH5 - ARM CONTROLS.SchDoc: Arm Controls
size B; CheckedBy: Lance Bantoto; Engineer: Christopher Arjune; Organization: UW Robotics; Address1: 200 University Avenue; Address2: Waterloo; Address3: Ontario; Address4: Canada N2L 3G6; Revision: 1; SheetNumber: 5; SheetTotal: 6
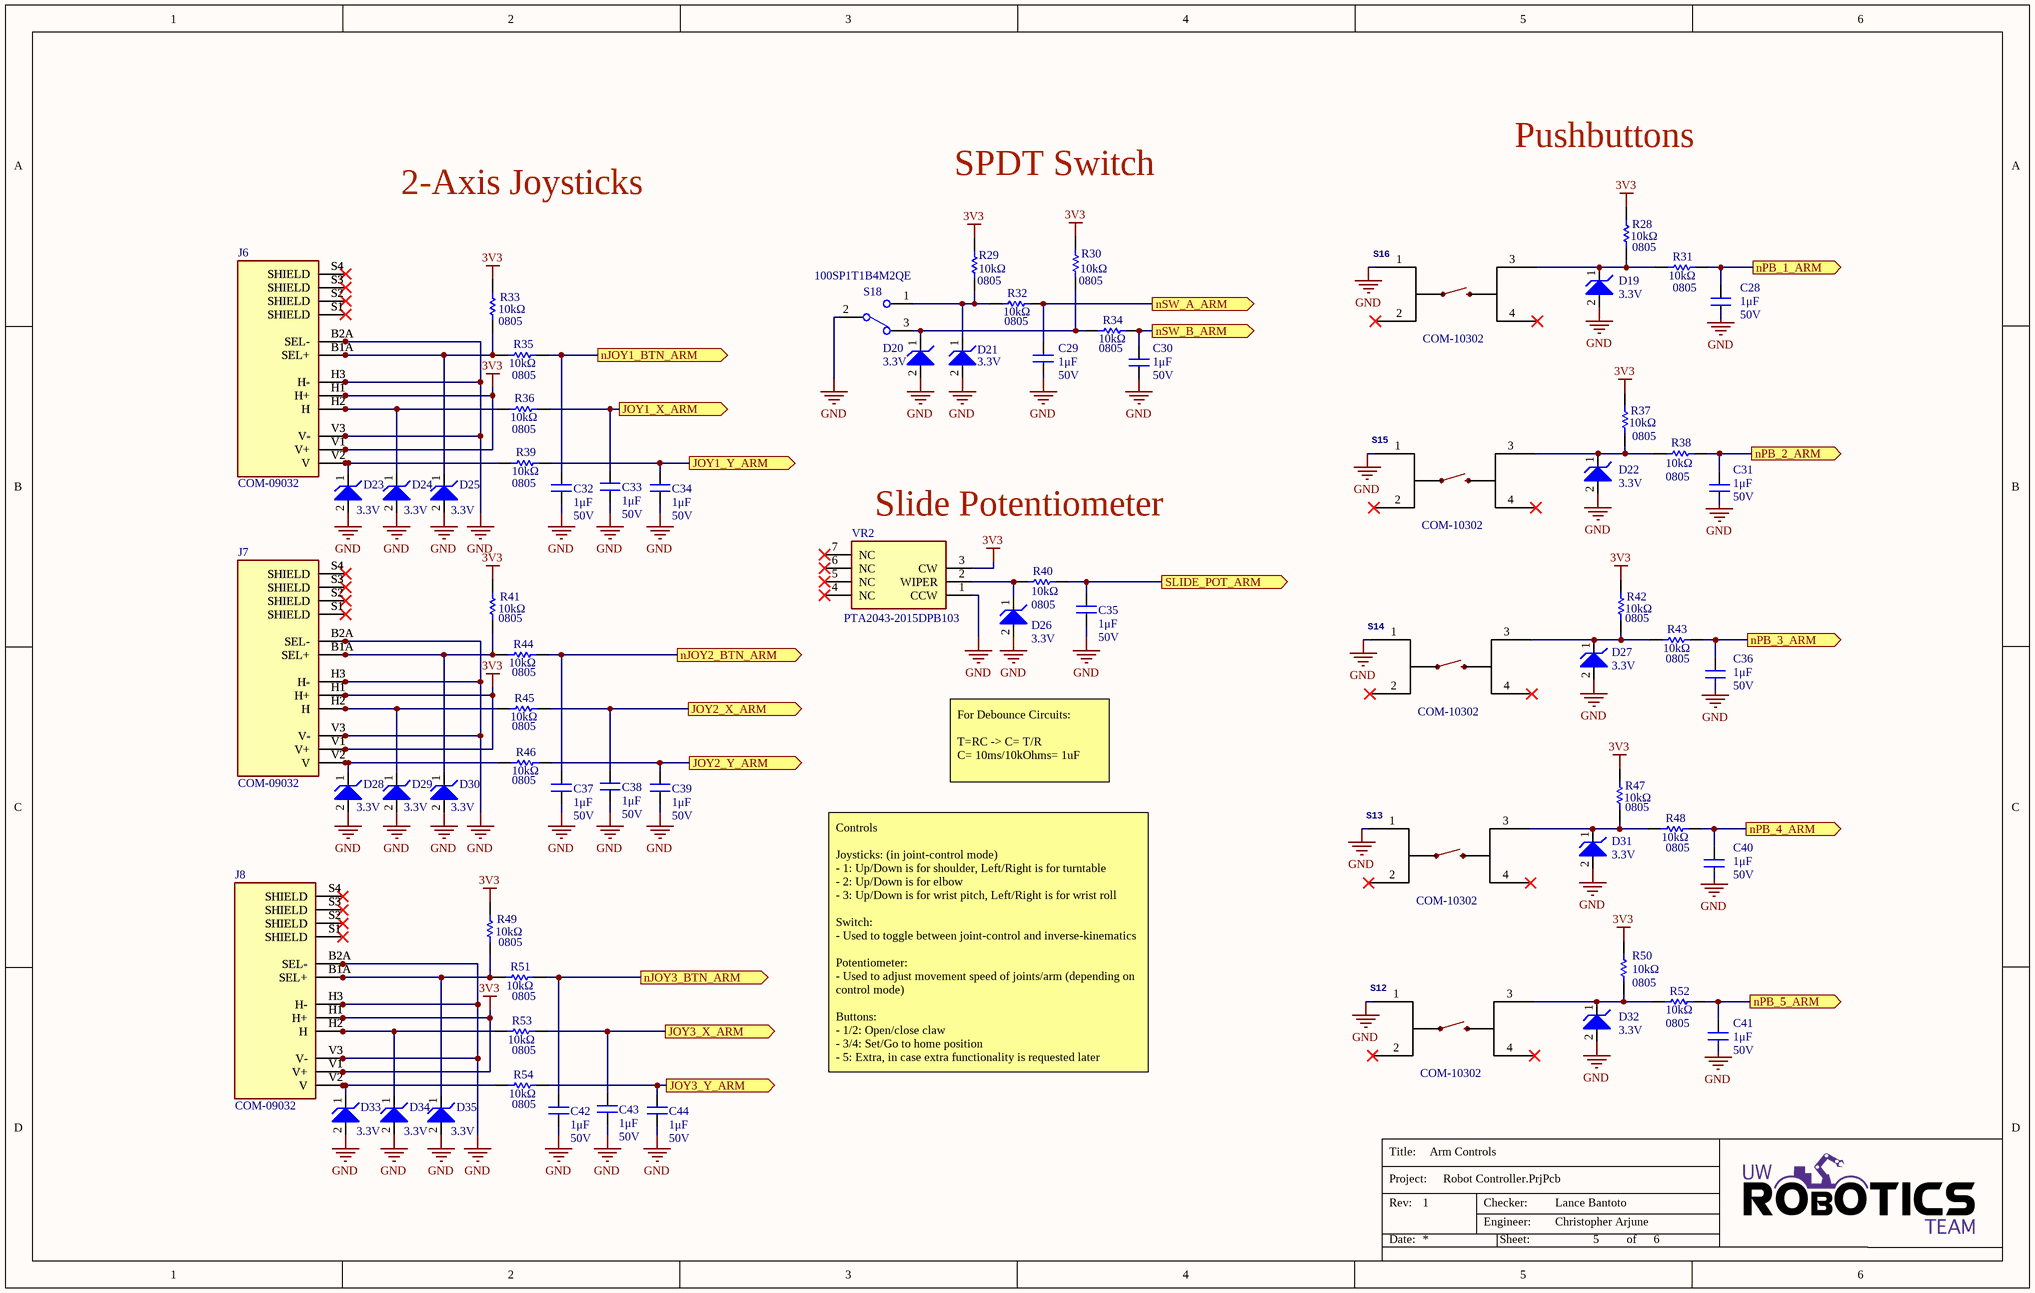
[diagram p4: SH5 - ARM CONTROLS.SchDoc]

### Parts
C28  value 1μF  Voltage Rating: 50V  [CAP2012]  (hidden comment: CAP_1uF_50V_0805)
C29  value 1μF  Voltage Rating: 50V  [CAP2012]  (hidden comment: CAP_1uF_50V_0805)
C30  value 1μF  Voltage Rating: 50V  [CAP2012]  (hidden comment: CAP_1uF_50V_0805)
C31  value 1μF  Voltage Rating: 50V  [CAP2012]  (hidden comment: CAP_1uF_50V_0805)
C32  value 1μF  Voltage Rating: 50V  [CAP2012]  (hidden comment: CAP_1uF_50V_0805)
C33  value 1μF  Voltage Rating: 50V  [CAP2012]  (hidden comment: CAP_1uF_50V_0805)
C34  value 1μF  Voltage Rating: 50V  [CAP2012]  (hidden comment: CAP_1uF_50V_0805)
C35  value 1μF  Voltage Rating: 50V  [CAP2012]  (hidden comment: CAP_1uF_50V_0805)
C36  value 1μF  Voltage Rating: 50V  [CAP2012]  (hidden comment: CAP_1uF_50V_0805)
C37  value 1μF  Voltage Rating: 50V  [CAP2012]  (hidden comment: CAP_1uF_50V_0805)
C38  value 1μF  Voltage Rating: 50V  [CAP2012]  (hidden comment: CAP_1uF_50V_0805)
C39  value 1μF  Voltage Rating: 50V  [CAP2012]  (hidden comment: CAP_1uF_50V_0805)
C40  value 1μF  Voltage Rating: 50V  [CAP2012]  (hidden comment: CAP_1uF_50V_0805)
C41  value 1μF  Voltage Rating: 50V  [CAP2012]  (hidden comment: CAP_1uF_50V_0805)
C42  value 1μF  Voltage Rating: 50V  [CAP2012]  (hidden comment: CAP_1uF_50V_0805)
C43  value 1μF  Voltage Rating: 50V  [CAP2012]  (hidden comment: CAP_1uF_50V_0805)
C44  value 1μF  Voltage Rating: 50V  [CAP2012]  (hidden comment: CAP_1uF_50V_0805)
D19  Voltage - Reverse Standoff (Typ): 3.3V  (hidden comment: TVS_DIODE_UNIDIR_3.3V)
D20  Voltage - Reverse Standoff (Typ): 3.3V  (hidden comment: TVS_DIODE_UNIDIR_3.3V)
D21  Voltage - Reverse Standoff (Typ): 3.3V  (hidden comment: TVS_DIODE_UNIDIR_3.3V)
D22  Voltage - Reverse Standoff (Typ): 3.3V  (hidden comment: TVS_DIODE_UNIDIR_3.3V)
D23  Voltage - Reverse Standoff (Typ): 3.3V  (hidden comment: TVS_DIODE_UNIDIR_3.3V)
D24  Voltage - Reverse Standoff (Typ): 3.3V  (hidden comment: TVS_DIODE_UNIDIR_3.3V)
D25  Voltage - Reverse Standoff (Typ): 3.3V  (hidden comment: TVS_DIODE_UNIDIR_3.3V)
D26  Voltage - Reverse Standoff (Typ): 3.3V  (hidden comment: TVS_DIODE_UNIDIR_3.3V)
D27  Voltage - Reverse Standoff (Typ): 3.3V  (hidden comment: TVS_DIODE_UNIDIR_3.3V)
D28  Voltage - Reverse Standoff (Typ): 3.3V  (hidden comment: TVS_DIODE_UNIDIR_3.3V)
D29  Voltage - Reverse Standoff (Typ): 3.3V  (hidden comment: TVS_DIODE_UNIDIR_3.3V)
D30  Voltage - Reverse Standoff (Typ): 3.3V  (hidden comment: TVS_DIODE_UNIDIR_3.3V)
D31  Voltage - Reverse Standoff (Typ): 3.3V  (hidden comment: TVS_DIODE_UNIDIR_3.3V)
D32  Voltage - Reverse Standoff (Typ): 3.3V  (hidden comment: TVS_DIODE_UNIDIR_3.3V)
D33  Voltage - Reverse Standoff (Typ): 3.3V  (hidden comment: TVS_DIODE_UNIDIR_3.3V)
D34  Voltage - Reverse Standoff (Typ): 3.3V  (hidden comment: TVS_DIODE_UNIDIR_3.3V)
D35  Voltage - Reverse Standoff (Typ): 3.3V  (hidden comment: TVS_DIODE_UNIDIR_3.3V)
J6  Manufacturer Part Number 1: COM-09032  [2_AXIS_JOYSTICK]  (hidden comment: 2_AXIS_JOYSTICK)
J7  Manufacturer Part Number 1: COM-09032  [2_AXIS_JOYSTICK]  (hidden comment: 2_AXIS_JOYSTICK)
J8  Manufacturer Part Number 1: COM-09032  [2_AXIS_JOYSTICK]  (hidden comment: 2_AXIS_JOYSTICK)
R28  value 10kΩ  Package/Footprint: 0805  [RESC0805]  (hidden comment: RES_10kΩ_0805_5%)
R29  value 10kΩ  Package/Footprint: 0805  [RESC0805]  (hidden comment: RES_10kΩ_0805_5%)
R30  value 10kΩ  Package/Footprint: 0805  [RESC0805]  (hidden comment: RES_10kΩ_0805_5%)
R31  value 10kΩ  Package/Footprint: 0805  [RESC0805]  (hidden comment: RES_10kΩ_0805_5%)
R32  value 10kΩ  Package/Footprint: 0805  [RESC0805]  (hidden comment: RES_10kΩ_0805_5%)
R33  value 10kΩ  Package/Footprint: 0805  [RESC0805]  (hidden comment: RES_10kΩ_0805_5%)
R34  value 10kΩ  Package/Footprint: 0805  [RESC0805]  (hidden comment: RES_10kΩ_0805_5%)
R35  value 10kΩ  Package/Footprint: 0805  [RESC0805]  (hidden comment: RES_10kΩ_0805_5%)
R36  value 10kΩ  Package/Footprint: 0805  [RESC0805]  (hidden comment: RES_10kΩ_0805_5%)
R37  value 10kΩ  Package/Footprint: 0805  [RESC0805]  (hidden comment: RES_10kΩ_0805_5%)
R38  value 10kΩ  Package/Footprint: 0805  [RESC0805]  (hidden comment: RES_10kΩ_0805_5%)
R39  value 10kΩ  Package/Footprint: 0805  [RESC0805]  (hidden comment: RES_10kΩ_0805_5%)
R40  value 10kΩ  Package/Footprint: 0805  [RESC0805]  (hidden comment: RES_10kΩ_0805_5%)
R41  value 10kΩ  Package/Footprint: 0805  [RESC0805]  (hidden comment: RES_10kΩ_0805_5%)
R42  value 10kΩ  Package/Footprint: 0805  [RESC0805]  (hidden comment: RES_10kΩ_0805_5%)
R43  value 10kΩ  Package/Footprint: 0805  [RESC0805]  (hidden comment: RES_10kΩ_0805_5%)
R44  value 10kΩ  Package/Footprint: 0805  [RESC0805]  (hidden comment: RES_10kΩ_0805_5%)
R45  value 10kΩ  Package/Footprint: 0805  [RESC0805]  (hidden comment: RES_10kΩ_0805_5%)
R46  value 10kΩ  Package/Footprint: 0805  [RESC0805]  (hidden comment: RES_10kΩ_0805_5%)
R47  value 10kΩ  Package/Footprint: 0805  [RESC0805]  (hidden comment: RES_10kΩ_0805_5%)
R48  value 10kΩ  Package/Footprint: 0805  [RESC0805]  (hidden comment: RES_10kΩ_0805_5%)
R49  value 10kΩ  Package/Footprint: 0805  [RESC0805]  (hidden comment: RES_10kΩ_0805_5%)
R50  value 10kΩ  Package/Footprint: 0805  [RESC0805]  (hidden comment: RES_10kΩ_0805_5%)
R51  value 10kΩ  Package/Footprint: 0805  [RESC0805]  (hidden comment: RES_10kΩ_0805_5%)
R52  value 10kΩ  Package/Footprint: 0805  [RESC0805]  (hidden comment: RES_10kΩ_0805_5%)
R53  value 10kΩ  Package/Footprint: 0805  [RESC0805]  (hidden comment: RES_10kΩ_0805_5%)
R54  value 10kΩ  Package/Footprint: 0805  [RESC0805]  (hidden comment: RES_10kΩ_0805_5%)
S12  Manufacturer Part Number 1: COM-10302  [TACTILE_SWITCH_PTH_12MM]  (hidden comment: SW_MOMENTARY_PUSHBUTTON)
S13  Manufacturer Part Number 1: COM-10302  [TACTILE_SWITCH_PTH_12MM]  (hidden comment: SW_MOMENTARY_PUSHBUTTON)
S14  Manufacturer Part Number 1: COM-10302  [TACTILE_SWITCH_PTH_12MM]  (hidden comment: SW_MOMENTARY_PUSHBUTTON)
S15  Manufacturer Part Number 1: COM-10302  [TACTILE_SWITCH_PTH_12MM]  (hidden comment: SW_MOMENTARY_PUSHBUTTON)
S16  Manufacturer Part Number 1: COM-10302  [TACTILE_SWITCH_PTH_12MM]  (hidden comment: SW_MOMENTARY_PUSHBUTTON)
S18  100SP1T1B4M2QE  [100SP1T1B4M2QE]
VR2  Manufacturer Part Number 1: PTA2043-2015DPB103  [PTA20432015CPB103]  (hidden comment: POT_10K_SLIDE)

### Ports
JOY1_X_ARM (out), JOY1_Y_ARM (out), JOY2_X_ARM (out), JOY2_Y_ARM (out), JOY3_X_ARM (out), JOY3_Y_ARM (out), nJOY1_BTN_ARM (out), nJOY2_BTN_ARM (out), nJOY3_BTN_ARM (out), nPB_1_ARM (out), nPB_2_ARM (out), nPB_3_ARM (out), nPB_4_ARM (out), nPB_5_ARM (out), nSW_A_ARM (out), nSW_B_ARM (out), SLIDE_POT_ARM (out)

### Nets
3V3: J6.H1(H+) J6.V1(V+) J7.H1(H+) J7.V1(V+) J8.H1(H+) J8.V1(V+) R28.1 R29.1 R30.1 R33.1 R37.1 R41.1 R42.1 R47.1 R49.1 R50.1 VR2.3(CW)
GND: C28.1 C29.1 C30.1 C31.1 C32.1 C33.1 C34.1 C35.1 C36.1 C37.1 C38.1 C39.1 C40.1 C41.1 C42.1 C43.1 C44.1 D19.2 D20.2 D21.2 D22.2 D23.2 D24.2 D25.2 D26.2 D27.2 D28.2 D29.2 D30.2 D31.2 D32.2 D33.2 D34.2 D35.2 J6.B2A(SEL-) J6.H3(H-) J6.V3(V-) J7.B2A(SEL-) J7.H3(H-) J7.V3(V-) J8.B2A(SEL-) J8.H3(H-) J8.V3(V-) S12.1 S13.1 S14.1 S15.1 S16.1 S18.2 VR2.1(CCW)
NetC28_2: C28.2 R31.2 ; port nPB_1_ARM
NetC29_2: C29.2 R32.2 ; port nSW_A_ARM
NetC30_2: C30.2 R34.2 ; port nSW_B_ARM
NetC31_2: C31.2 R38.2 ; port nPB_2_ARM
NetC32_2: C32.2 R35.2 ; port nJOY1_BTN_ARM
NetC33_2: C33.2 R36.2 ; port JOY1_X_ARM
NetC34_2: C34.2 R39.2 ; port JOY1_Y_ARM
NetC35_2: C35.2 R40.2 ; port SLIDE_POT_ARM
NetC36_2: C36.2 R43.2 ; port nPB_3_ARM
NetC37_2: C37.2 R44.2 ; port nJOY2_BTN_ARM
NetC38_2: C38.2 R45.2 ; port JOY2_X_ARM
NetC39_2: C39.2 R46.2 ; port JOY2_Y_ARM
NetC40_2: C40.2 R48.2 ; port nPB_4_ARM
NetC41_2: C41.2 R52.2 ; port nPB_5_ARM
NetC42_2: C42.2 R51.2 ; port nJOY3_BTN_ARM
NetC43_2: C43.2 R53.2 ; port JOY3_X_ARM
NetC44_2: C44.2 R54.2 ; port JOY3_Y_ARM
NetD19_1: D19.1 R28.2 R31.1 S16.3
NetD20_1: D20.1 R30.2 R34.1 S18.3
NetD21_1: D21.1 R29.2 R32.1 S18.1
NetD22_1: D22.1 R37.2 R38.1 S15.3
NetD23_1: D23.1 J6.V2(V) R39.1
NetD24_1: D24.1 J6.H2(H) R36.1
NetD25_1: D25.1 J6.B1A(SEL+) R33.2 R35.1
NetD26_1: D26.1 R40.1 VR2.2(WIPER)
NetD27_1: D27.1 R42.2 R43.1 S14.3
NetD28_1: D28.1 J7.V2(V) R46.1
NetD29_1: D29.1 J7.H2(H) R45.1
NetD30_1: D30.1 J7.B1A(SEL+) R41.2 R44.1
NetD31_1: D31.1 R47.2 R48.1 S13.3
NetD32_1: D32.1 R50.2 R52.1 S12.3
NetD33_1: D33.1 J8.V2(V) R54.1
NetD34_1: D34.1 J8.H2(H) R53.1
NetD35_1: D35.1 J8.B1A(SEL+) R49.2 R51.1

Not connected (* = marked no-connect by the designer): J6 S1(SHIELD)* S2(SHIELD)* S3(SHIELD)* S4(SHIELD)*; J7 S1(SHIELD)* S2(SHIELD)* S3(SHIELD)* S4(SHIELD)*; J8 S1(SHIELD)* S2(SHIELD)* S3(SHIELD)* S4(SHIELD)*; S12 2* 4*; S13 2* 4*; S14 2* 4*; S15 2* 4*; S16 2* 4*; VR2 4(NC)* 5(NC)* 6(NC)* 7(NC)*

### Notes on the sheet
- Pushbuttons
- 2-Axis Joysticks
- SPDT Switch
- (near VR2) Slide Potentiometer
- For Debounce Circuits:
  T=RC -> C= T/R
  C= 10ms/10kOhms= 1uF
- Controls
  Joysticks: (in joint-control mode)
  - 1: Up/Down is for shoulder, Left/Right is for turntable
  - 2: Up/Down is for elbow
  - 3: Up/Down is for wrist pitch, Left/Right is for wrist roll
  Switch:
  - Used to toggle between joint-control and inverse-kinematics
  Potentiometer:
  - Used to adjust movement speed of joints/arm (depending on control mode)
  Buttons:
  - 1/2: Open/close claw
  - 3/4: Set/Go to home position
  - 5: Extra, in case extra functionality is requested later
- Title:
- Project:
- Date:
- Rev:
- Checker:
- Engineer:
- Sheet:
- of

### Library data of the parts
C28-C44 = CAP_1uF_50V_0805: as C1 on sheet SH1 - POWER; Supplier 1: Digi-Key; Supplier Part Number 1: 1276-6470-1-ND; Mounting Type: SMD; LCSC Part #: C28323
D19-D35 = TVS_DIODE_UNIDIR_3.3V: as D8 on sheet SH4 - GIMBDRIVE CONTROLS; Supplier 1: Digi-Key; Supplier Part Number 1: ESD5Z3.3T1GOSCT-ND; Mounting Type: SMD; LCSC Part #: C61148; Voltage - Clamping (Max) @ Ipp: 14.1V
J6-J8 = 2_AXIS_JOYSTICK: as J5 on sheet SH4 - GIMBDRIVE CONTROLS; Supplier 1: Digi-Key; Supplier Part Number 1: 1568-1526-ND; Verified: No; Mounting Type: TH; Package/Footprint: TH; LCSC Part #: *
R28-R54 = RES_10kΩ_0805_5%: as R5 on sheet SH2 - MCU; Supplier 1: Digi-Key; Supplier Part Number 1: P10KACT-ND; LCSC Part #: C17414; Mounting Type: SMD
S12-S16 = SW_MOMENTARY_PUSHBUTTON: as S1 on sheet SH4 - GIMBDRIVE CONTROLS; Supplier 1: Digi-Key; Supplier Part Number 1: 1568-1332-ND; Mounting Type: TH; Verified: No
S18 = SW_SPDT: as S17 on sheet SH4 - GIMBDRIVE CONTROLS; Supplier 1: Digi-Key; Manufacturer Part Number 1: 100SP1T1B4M2QE; Throw Configuration: SPDT; Supplier Part Number 1: EG2355-ND; Mounting Type: TH
VR2 = POT_10K_SLIDE: as VR1 on sheet SH4 - GIMBDRIVE CONTROLS; Supplier 1: Digi-Key; Supplier Part Number 1: PTA2043-2015DPB103-ND

## Sheet SH6 - SCIENCE CONTROLS.SchDoc: Science Controls
size B; CheckedBy: Lance Bantoto; Engineer: Christopher Arjune; Organization: UW Robotics; Address1: 200 University Avenue; Address2: Waterloo; Address3: Ontario; Address4: Canada N2L 3G6; Revision: 1; SheetNumber: 6; SheetTotal: 6
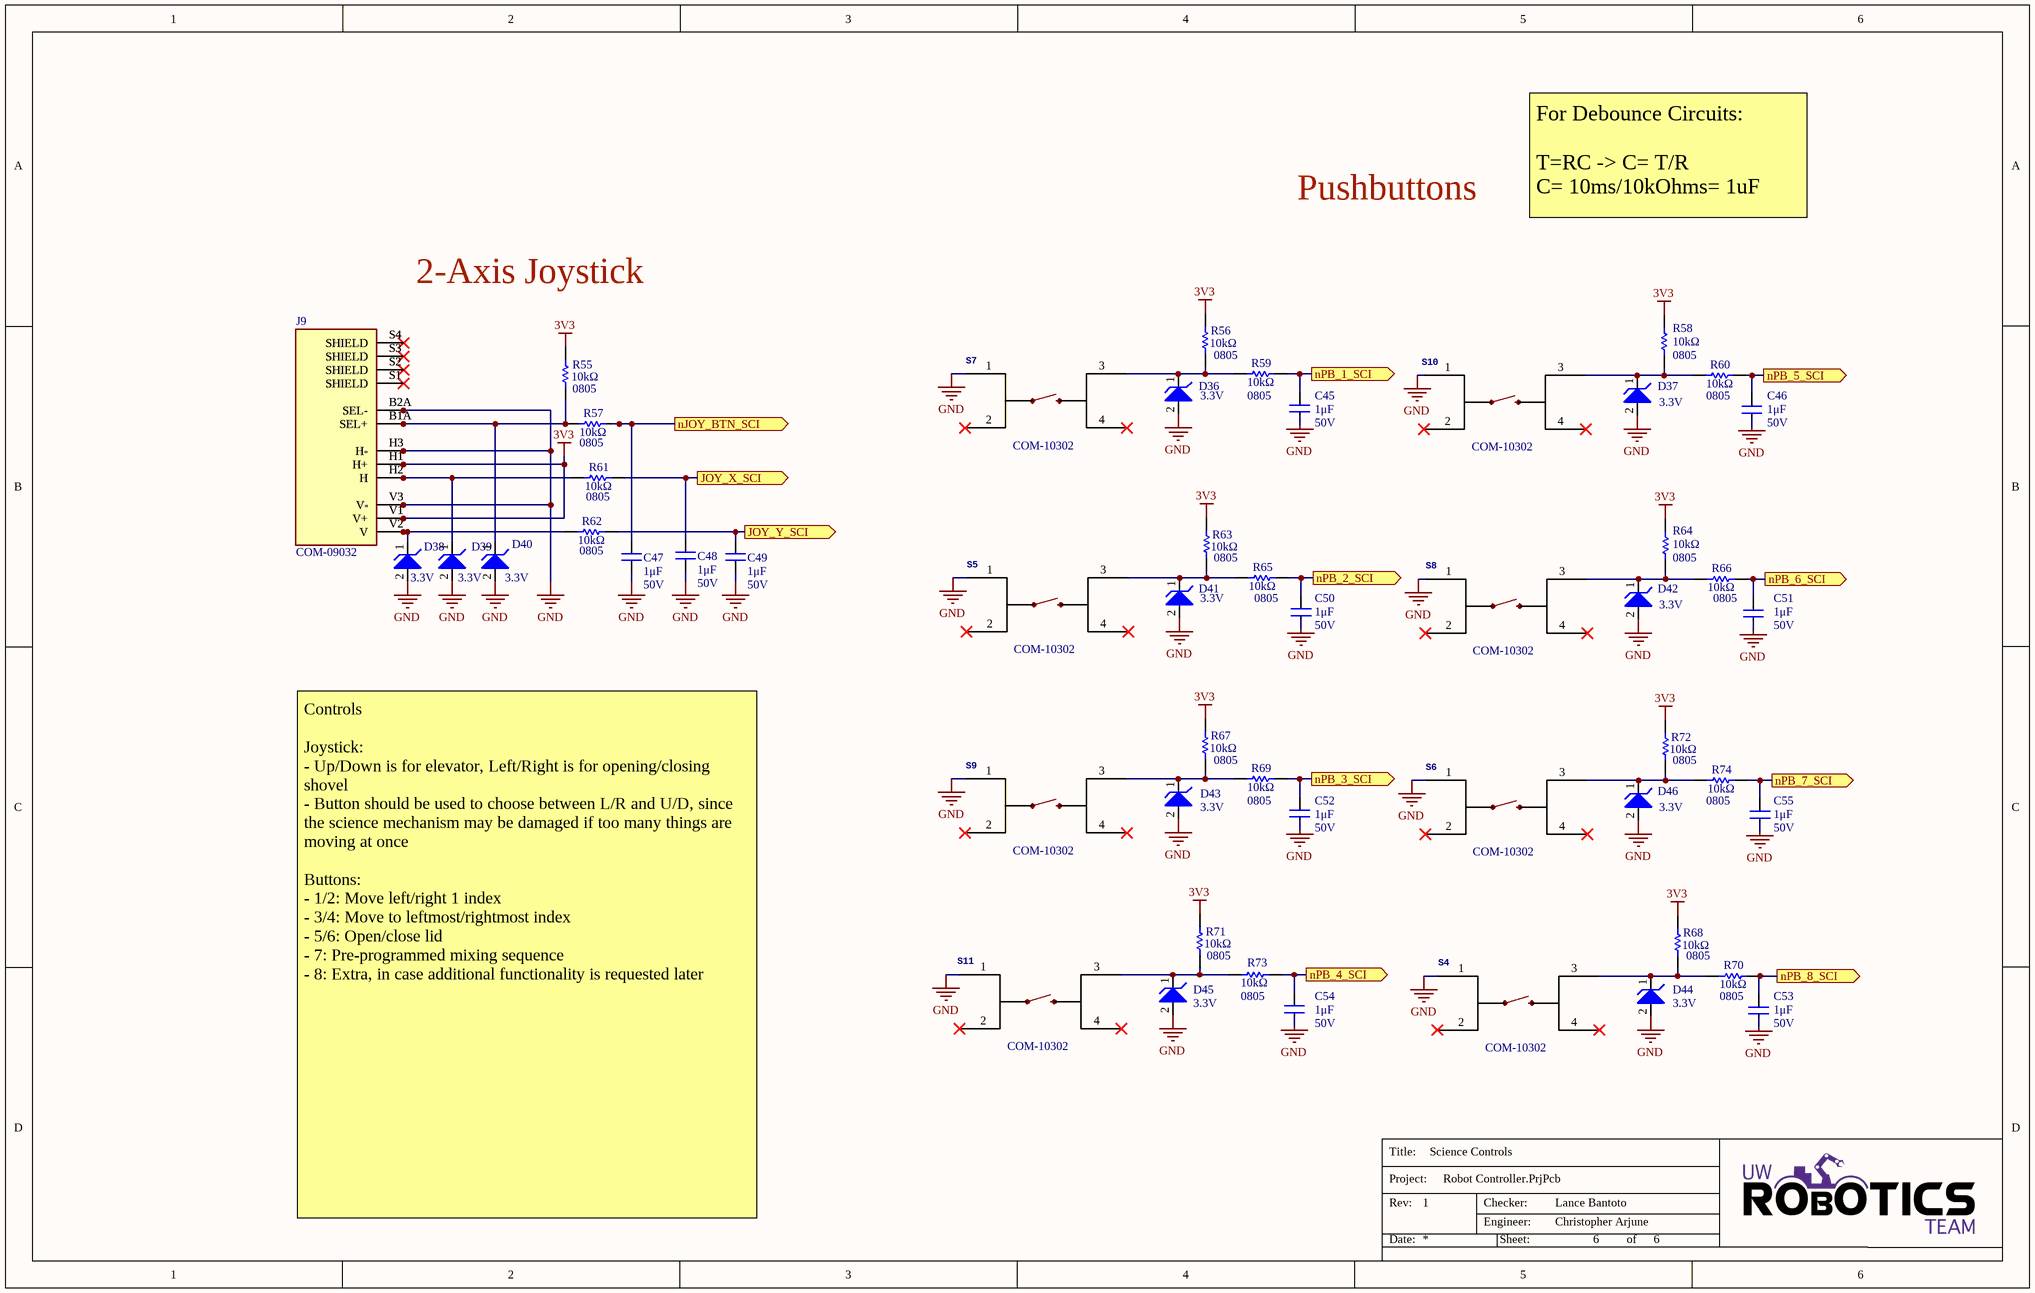
[diagram p5: SH6 - SCIENCE CONTROLS.SchDoc]

### Parts
C45  value 1μF  Voltage Rating: 50V  [CAP2012]  (hidden comment: CAP_1uF_50V_0805)
C46  value 1μF  Voltage Rating: 50V  [CAP2012]  (hidden comment: CAP_1uF_50V_0805)
C47  value 1μF  Voltage Rating: 50V  [CAP2012]  (hidden comment: CAP_1uF_50V_0805)
C48  value 1μF  Voltage Rating: 50V  [CAP2012]  (hidden comment: CAP_1uF_50V_0805)
C49  value 1μF  Voltage Rating: 50V  [CAP2012]  (hidden comment: CAP_1uF_50V_0805)
C50  value 1μF  Voltage Rating: 50V  [CAP2012]  (hidden comment: CAP_1uF_50V_0805)
C51  value 1μF  Voltage Rating: 50V  [CAP2012]  (hidden comment: CAP_1uF_50V_0805)
C52  value 1μF  Voltage Rating: 50V  [CAP2012]  (hidden comment: CAP_1uF_50V_0805)
C53  value 1μF  Voltage Rating: 50V  [CAP2012]  (hidden comment: CAP_1uF_50V_0805)
C54  value 1μF  Voltage Rating: 50V  [CAP2012]  (hidden comment: CAP_1uF_50V_0805)
C55  value 1μF  Voltage Rating: 50V  [CAP2012]  (hidden comment: CAP_1uF_50V_0805)
D36  Voltage - Reverse Standoff (Typ): 3.3V  (hidden comment: TVS_DIODE_UNIDIR_3.3V)
D37  Voltage - Reverse Standoff (Typ): 3.3V  (hidden comment: TVS_DIODE_UNIDIR_3.3V)
D38  Voltage - Reverse Standoff (Typ): 3.3V  (hidden comment: TVS_DIODE_UNIDIR_3.3V)
D39  Voltage - Reverse Standoff (Typ): 3.3V  (hidden comment: TVS_DIODE_UNIDIR_3.3V)
D40  Voltage - Reverse Standoff (Typ): 3.3V  (hidden comment: TVS_DIODE_UNIDIR_3.3V)
D41  Voltage - Reverse Standoff (Typ): 3.3V  (hidden comment: TVS_DIODE_UNIDIR_3.3V)
D42  Voltage - Reverse Standoff (Typ): 3.3V  (hidden comment: TVS_DIODE_UNIDIR_3.3V)
D43  Voltage - Reverse Standoff (Typ): 3.3V  (hidden comment: TVS_DIODE_UNIDIR_3.3V)
D44  Voltage - Reverse Standoff (Typ): 3.3V  (hidden comment: TVS_DIODE_UNIDIR_3.3V)
D45  Voltage - Reverse Standoff (Typ): 3.3V  (hidden comment: TVS_DIODE_UNIDIR_3.3V)
D46  Voltage - Reverse Standoff (Typ): 3.3V  (hidden comment: TVS_DIODE_UNIDIR_3.3V)
J9  Manufacturer Part Number 1: COM-09032  [2_AXIS_JOYSTICK]  (hidden comment: 2_AXIS_JOYSTICK)
R55  value 10kΩ  Package/Footprint: 0805  [RESC0805]  (hidden comment: RES_10kΩ_0805_5%)
R56  value 10kΩ  Package/Footprint: 0805  [RESC0805]  (hidden comment: RES_10kΩ_0805_5%)
R57  value 10kΩ  Package/Footprint: 0805  [RESC0805]  (hidden comment: RES_10kΩ_0805_5%)
R58  value 10kΩ  Package/Footprint: 0805  [RESC0805]  (hidden comment: RES_10kΩ_0805_5%)
R59  value 10kΩ  Package/Footprint: 0805  [RESC0805]  (hidden comment: RES_10kΩ_0805_5%)
R60  value 10kΩ  Package/Footprint: 0805  [RESC0805]  (hidden comment: RES_10kΩ_0805_5%)
R61  value 10kΩ  Package/Footprint: 0805  [RESC0805]  (hidden comment: RES_10kΩ_0805_5%)
R62  value 10kΩ  Package/Footprint: 0805  [RESC0805]  (hidden comment: RES_10kΩ_0805_5%)
R63  value 10kΩ  Package/Footprint: 0805  [RESC0805]  (hidden comment: RES_10kΩ_0805_5%)
R64  value 10kΩ  Package/Footprint: 0805  [RESC0805]  (hidden comment: RES_10kΩ_0805_5%)
R65  value 10kΩ  Package/Footprint: 0805  [RESC0805]  (hidden comment: RES_10kΩ_0805_5%)
R66  value 10kΩ  Package/Footprint: 0805  [RESC0805]  (hidden comment: RES_10kΩ_0805_5%)
R67  value 10kΩ  Package/Footprint: 0805  [RESC0805]  (hidden comment: RES_10kΩ_0805_5%)
R68  value 10kΩ  Package/Footprint: 0805  [RESC0805]  (hidden comment: RES_10kΩ_0805_5%)
R69  value 10kΩ  Package/Footprint: 0805  [RESC0805]  (hidden comment: RES_10kΩ_0805_5%)
R70  value 10kΩ  Package/Footprint: 0805  [RESC0805]  (hidden comment: RES_10kΩ_0805_5%)
R71  value 10kΩ  Package/Footprint: 0805  [RESC0805]  (hidden comment: RES_10kΩ_0805_5%)
R72  value 10kΩ  Package/Footprint: 0805  [RESC0805]  (hidden comment: RES_10kΩ_0805_5%)
R73  value 10kΩ  Package/Footprint: 0805  [RESC0805]  (hidden comment: RES_10kΩ_0805_5%)
R74  value 10kΩ  Package/Footprint: 0805  [RESC0805]  (hidden comment: RES_10kΩ_0805_5%)
S4  Manufacturer Part Number 1: COM-10302  [TACTILE_SWITCH_PTH_12MM]  (hidden comment: SW_MOMENTARY_PUSHBUTTON)
S5  Manufacturer Part Number 1: COM-10302  [TACTILE_SWITCH_PTH_12MM]  (hidden comment: SW_MOMENTARY_PUSHBUTTON)
S6  Manufacturer Part Number 1: COM-10302  [TACTILE_SWITCH_PTH_12MM]  (hidden comment: SW_MOMENTARY_PUSHBUTTON)
S7  Manufacturer Part Number 1: COM-10302  [TACTILE_SWITCH_PTH_12MM]  (hidden comment: SW_MOMENTARY_PUSHBUTTON)
S8  Manufacturer Part Number 1: COM-10302  [TACTILE_SWITCH_PTH_12MM]  (hidden comment: SW_MOMENTARY_PUSHBUTTON)
S9  Manufacturer Part Number 1: COM-10302  [TACTILE_SWITCH_PTH_12MM]  (hidden comment: SW_MOMENTARY_PUSHBUTTON)
S10  Manufacturer Part Number 1: COM-10302  [TACTILE_SWITCH_PTH_12MM]  (hidden comment: SW_MOMENTARY_PUSHBUTTON)
S11  Manufacturer Part Number 1: COM-10302  [TACTILE_SWITCH_PTH_12MM]  (hidden comment: SW_MOMENTARY_PUSHBUTTON)

### Ports
JOY_X_SCI (out), JOY_Y_SCI (out), nJOY_BTN_SCI (out), nPB_1_SCI (out), nPB_2_SCI (out), nPB_3_SCI (out), nPB_4_SCI (out), nPB_5_SCI (out), nPB_6_SCI (out), nPB_7_SCI (out), nPB_8_SCI (out)

### Nets
3V3: J9.H1(H+) J9.V1(V+) R55.1 R56.1 R58.1 R63.1 R64.1 R67.1 R68.1 R71.1 R72.1
GND: C45.1 C46.1 C47.1 C48.1 C49.1 C50.1 C51.1 C52.1 C53.1 C54.1 C55.1 D36.2 D37.2 D38.2 D39.2 D40.2 D41.2 D42.2 D43.2 D44.2 D45.2 D46.2 J9.B2A(SEL-) J9.H3(H-) J9.V3(V-) S4.1 S5.1 S6.1 S7.1 S8.1 S9.1 S10.1 S11.1
NetC45_2: C45.2 R59.2 ; port nPB_1_SCI
NetC46_2: C46.2 R60.2 ; port nPB_5_SCI
NetC47_2: C47.2 R57.2 ; port nJOY_BTN_SCI
NetC48_2: C48.2 R61.2 ; port JOY_X_SCI
NetC49_2: C49.2 R62.2 ; port JOY_Y_SCI
NetC50_2: C50.2 R65.2 ; port nPB_2_SCI
NetC51_2: C51.2 R66.2 ; port nPB_6_SCI
NetC52_2: C52.2 R69.2 ; port nPB_3_SCI
NetC53_2: C53.2 R70.2 ; port nPB_8_SCI
NetC54_2: C54.2 R73.2 ; port nPB_4_SCI
NetC55_2: C55.2 R74.2 ; port nPB_7_SCI
NetD36_1: D36.1 R56.2 R59.1 S7.3
NetD37_1: D37.1 R58.2 R60.1 S10.3
NetD38_1: D38.1 J9.V2(V) R62.1
NetD39_1: D39.1 J9.H2(H) R61.1
NetD40_1: D40.1 J9.B1A(SEL+) R55.2 R57.1
NetD41_1: D41.1 R63.2 R65.1 S5.3
NetD42_1: D42.1 R64.2 R66.1 S8.3
NetD43_1: D43.1 R67.2 R69.1 S9.3
NetD44_1: D44.1 R68.2 R70.1 S4.3
NetD45_1: D45.1 R71.2 R73.1 S11.3
NetD46_1: D46.1 R72.2 R74.1 S6.3

Not connected (* = marked no-connect by the designer): J9 S1(SHIELD)* S2(SHIELD)* S3(SHIELD)* S4(SHIELD)*; S4 2* 4*; S5 2* 4*; S6 2* 4*; S7 2* 4*; S8 2* 4*; S9 2* 4*; S10 2* 4*; S11 2* 4*

### Notes on the sheet
- Pushbuttons
- For Debounce Circuits:
  T=RC -> C= T/R
  C= 10ms/10kOhms= 1uF
- 2-Axis Joystick
- Controls
  Joystick:
  - Up/Down is for elevator, Left/Right is for opening/closing shovel
  - Button should be used to choose between L/R and U/D, since the science mechanism may be damaged if too many things are moving at once
  Buttons:
  - 1/2: Move left/right 1 index
  - 3/4: Move to leftmost/rightmost index
  - 5/6: Open/close lid
  - 7: Pre-programmed mixing sequence
  - 8: Extra, in case additional functionality is requested later
- Title:
- Project:
- Date:
- Rev:
- Checker:
- Engineer:
- Sheet:
- of

### Library data of the parts
C45-C55 = CAP_1uF_50V_0805: as C1 on sheet SH1 - POWER; Supplier 1: Digi-Key; Supplier Part Number 1: 1276-6470-1-ND; Mounting Type: SMD; LCSC Part #: C28323
D36-D46 = TVS_DIODE_UNIDIR_3.3V: as D8 on sheet SH4 - GIMBDRIVE CONTROLS; Supplier 1: Digi-Key; Supplier Part Number 1: ESD5Z3.3T1GOSCT-ND; Mounting Type: SMD; LCSC Part #: C61148; Voltage - Clamping (Max) @ Ipp: 14.1V
J9 = 2_AXIS_JOYSTICK: as J5 on sheet SH4 - GIMBDRIVE CONTROLS; Supplier 1: Digi-Key; Supplier Part Number 1: 1568-1526-ND; Verified: No; Mounting Type: TH; Package/Footprint: TH; LCSC Part #: *
R55-R74 = RES_10kΩ_0805_5%: as R5 on sheet SH2 - MCU; Supplier 1: Digi-Key; Supplier Part Number 1: P10KACT-ND; LCSC Part #: C17414; Mounting Type: SMD
S4-S11 = SW_MOMENTARY_PUSHBUTTON: as S1 on sheet SH4 - GIMBDRIVE CONTROLS; Supplier 1: Digi-Key; Supplier Part Number 1: 1568-1332-ND; Mounting Type: TH; Verified: No

## Nets that join several sheets
3V3: SH1 - POWER (C3.1 R1.2 TP2.1 U1.5), SH2 - MCU (17 pins), SH4 - GIMBDRIVE CONTROLS (11 pins), SH5 - ARM CONTROLS (17 pins), SH6 - SCIENCE CONTROLS (11 pins)
5V: SH1 - POWER (5 pins), SH3 - USB (D47.2)
GND: SH1 - POWER (7 pins), SH2 - MCU (24 pins), SH3 - USB (5 pins), SH4 - GIMBDRIVE CONTROLS (32 pins), SH5 - ARM CONTROLS (50 pins), SH6 - SCIENCE CONTROLS (33 pins)
NetC17_2: SH2 - MCU (U2.9), SH4 - GIMBDRIVE CONTROLS (C17.2 R11.2)
NetC18_2: SH2 - MCU (U2.41), SH4 - GIMBDRIVE CONTROLS (C18.2 R13.2)
NetC19_2: SH2 - MCU (U2.15), SH4 - GIMBDRIVE CONTROLS (C19.2 R14.2)
NetC20_2: SH2 - MCU (U2.16), SH4 - GIMBDRIVE CONTROLS (C20.2 R15.2)
NetC21_2: SH2 - MCU (U2.40), SH4 - GIMBDRIVE CONTROLS (C21.2 R17.2)
NetC22_2: SH2 - MCU (U2.39), SH4 - GIMBDRIVE CONTROLS (C22.2 R22.2)
NetC23_2: SH2 - MCU (U2.8), SH4 - GIMBDRIVE CONTROLS (C23.2 R19.2)
NetC24_2: SH2 - MCU (U2.14), SH4 - GIMBDRIVE CONTROLS (C24.2 R21.2)
NetC25_2: SH2 - MCU (U2.11), SH4 - GIMBDRIVE CONTROLS (C25.2 R23.2)
NetC26_2: SH2 - MCU (U2.52), SH4 - GIMBDRIVE CONTROLS (C26.2 R26.2)
NetC27_2: SH2 - MCU (U2.53), SH4 - GIMBDRIVE CONTROLS (C27.2 R27.2)
NetC28_2: SH2 - MCU (U2.59), SH5 - ARM CONTROLS (C28.2 R31.2)
NetC29_2: SH2 - MCU (U2.62), SH5 - ARM CONTROLS (C29.2 R32.2)
NetC30_2: SH2 - MCU (U2.61), SH5 - ARM CONTROLS (C30.2 R34.2)
NetC31_2: SH2 - MCU (U2.58), SH5 - ARM CONTROLS (C31.2 R38.2)
NetC32_2: SH2 - MCU (U2.27), SH5 - ARM CONTROLS (C32.2 R35.2)
NetC33_2: SH2 - MCU (U2.21), SH5 - ARM CONTROLS (C33.2 R36.2)
NetC34_2: SH2 - MCU (U2.22), SH5 - ARM CONTROLS (C34.2 R39.2)
NetC35_2: SH2 - MCU (U2.10), SH5 - ARM CONTROLS (C35.2 R40.2)
NetC36_2: SH2 - MCU (U2.57), SH5 - ARM CONTROLS (C36.2 R43.2)
NetC37_2: SH2 - MCU (U2.28), SH5 - ARM CONTROLS (C37.2 R44.2)
NetC38_2: SH2 - MCU (U2.23), SH5 - ARM CONTROLS (C38.2 R45.2)
NetC39_2: SH2 - MCU (U2.24), SH5 - ARM CONTROLS (C39.2 R46.2)
NetC40_2: SH2 - MCU (U2.56), SH5 - ARM CONTROLS (C40.2 R48.2)
NetC41_2: SH2 - MCU (U2.54), SH5 - ARM CONTROLS (C41.2 R52.2)
NetC42_2: SH2 - MCU (U2.29), SH5 - ARM CONTROLS (C42.2 R51.2)
NetC43_2: SH2 - MCU (U2.25), SH5 - ARM CONTROLS (C43.2 R53.2)
NetC44_2: SH2 - MCU (U2.26), SH5 - ARM CONTROLS (C44.2 R54.2)
NetC45_2: SH2 - MCU (U2.43), SH6 - SCIENCE CONTROLS (C45.2 R59.2)
NetC46_2: SH2 - MCU (U2.36), SH6 - SCIENCE CONTROLS (C46.2 R60.2)
NetC47_2: SH2 - MCU (U2.51), SH6 - SCIENCE CONTROLS (C47.2 R57.2)
NetC48_2: SH2 - MCU (U2.20), SH6 - SCIENCE CONTROLS (C48.2 R61.2)
NetC49_2: SH2 - MCU (U2.17), SH6 - SCIENCE CONTROLS (C49.2 R62.2)
NetC50_2: SH2 - MCU (U2.42), SH6 - SCIENCE CONTROLS (C50.2 R65.2)
NetC51_2: SH2 - MCU (U2.35), SH6 - SCIENCE CONTROLS (C51.2 R66.2)
NetC52_2: SH2 - MCU (U2.38), SH6 - SCIENCE CONTROLS (C52.2 R69.2)
NetC53_2: SH2 - MCU (U2.33), SH6 - SCIENCE CONTROLS (C53.2 R70.2)
NetC54_2: SH2 - MCU (U2.37), SH6 - SCIENCE CONTROLS (C54.2 R73.2)
NetC55_2: SH2 - MCU (U2.34), SH6 - SCIENCE CONTROLS (C55.2 R74.2)
USBD_N: SH2 - MCU (U2.44), SH3 - USB (R9.2 TP5.1)
USBD_P: SH2 - MCU (U2.45), SH3 - USB (R10.2 TP6.1)